# Altium project yard-ice.PrjPCB
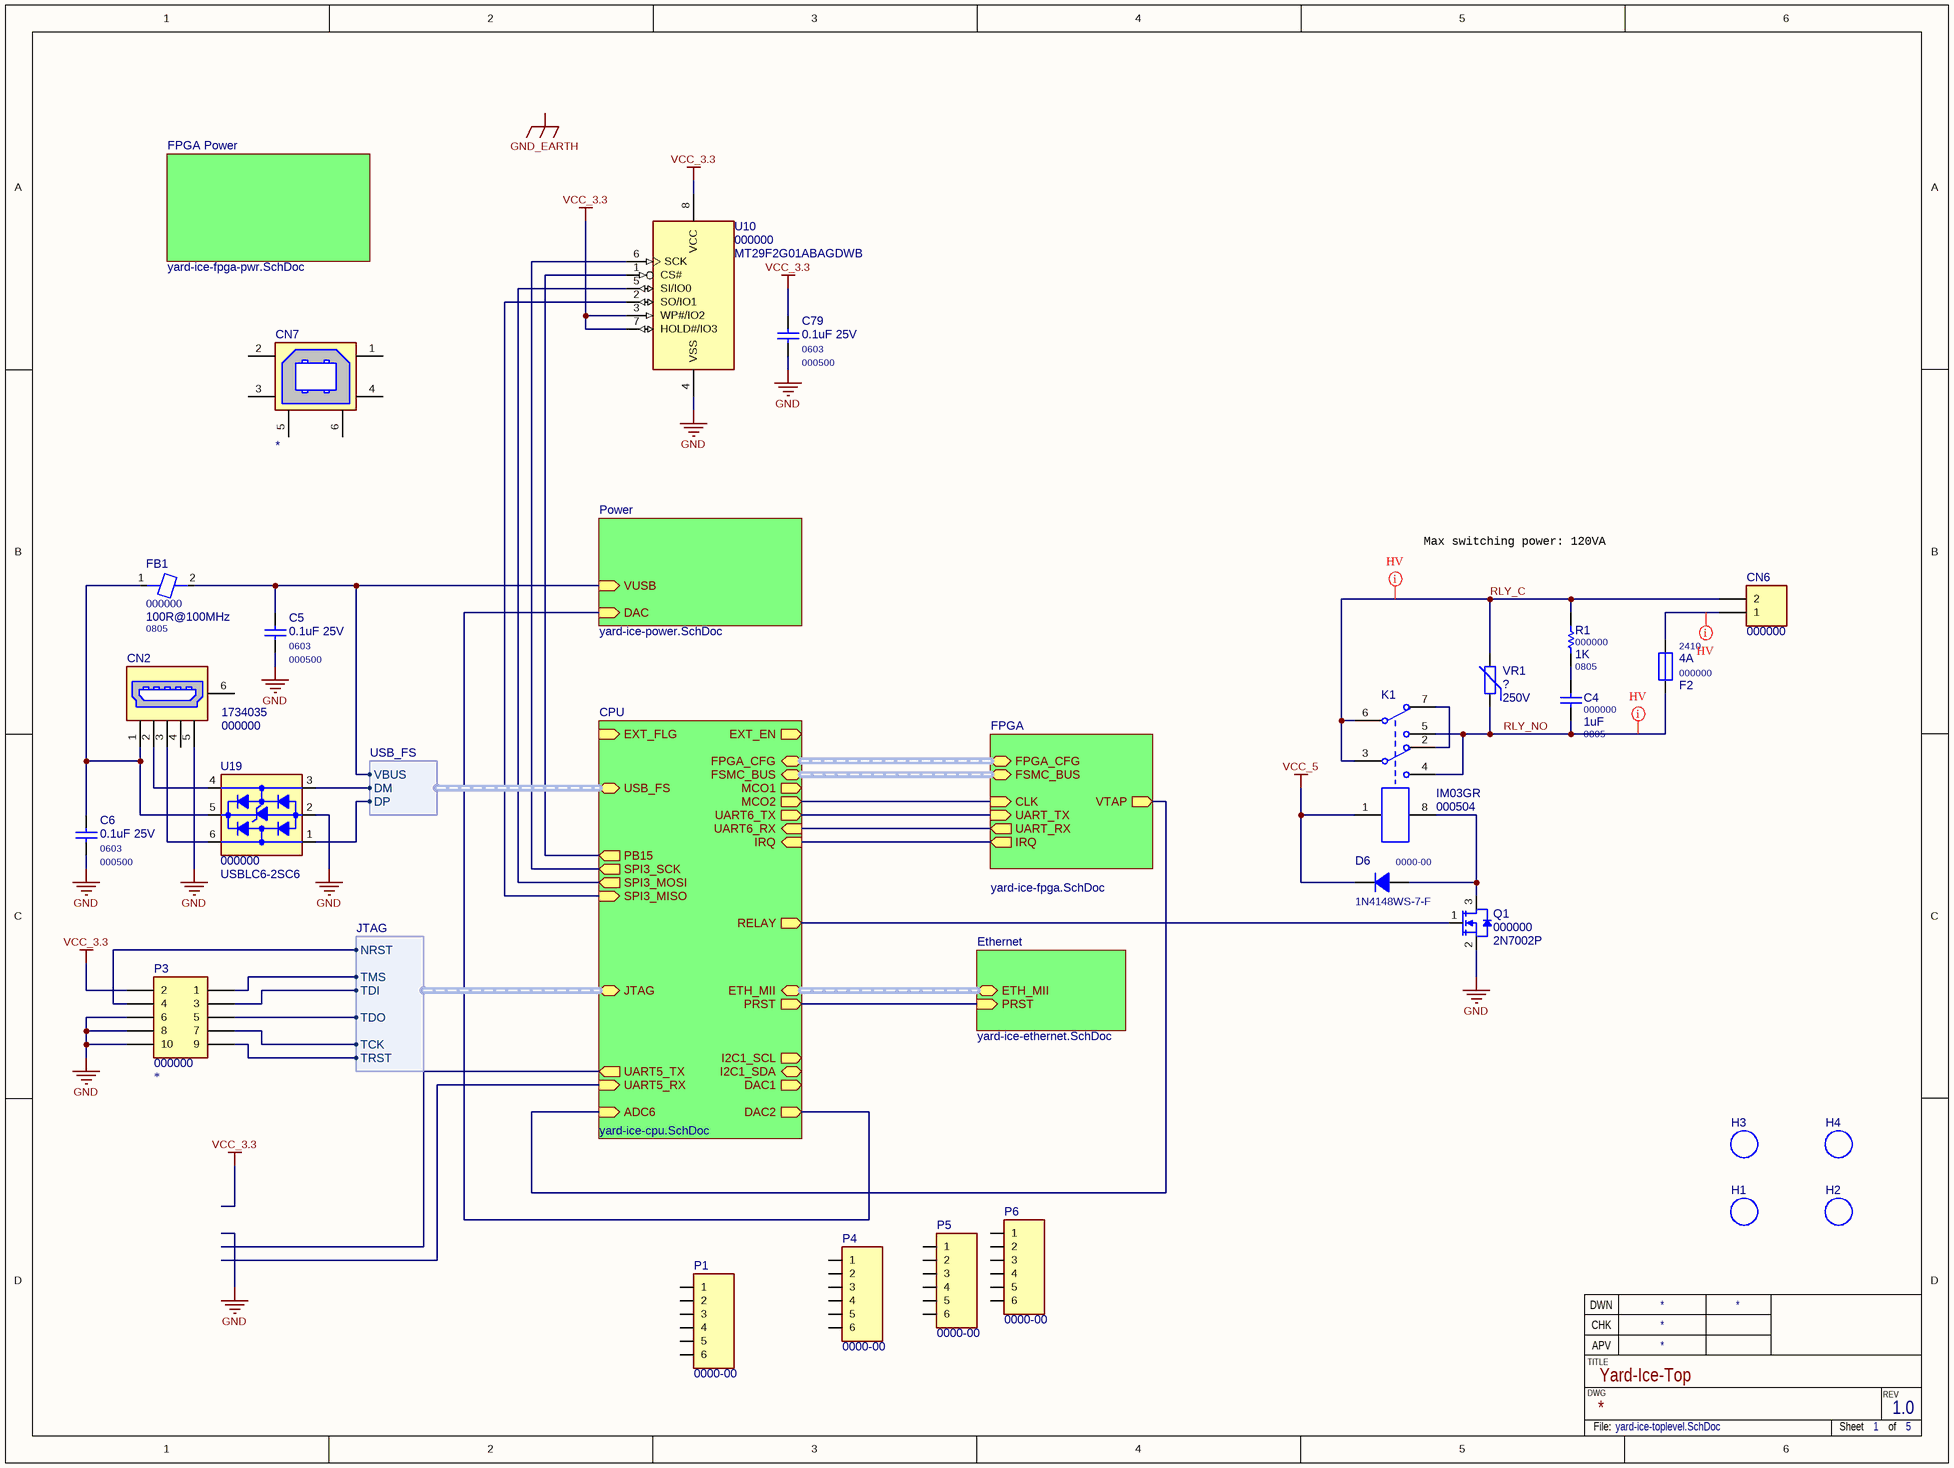
[diagram p0: yard-ice-toplevel.SchDoc]
6 sheets, 176 parts. Net scope: hierarchical (ports join the sheet entries above them; power ports are global).
Board file: yard-ice.PcbDoc
Sheets:
  yard-ice-toplevel.SchDoc
    Power = yard-ice-power.SchDoc
    CPU = yard-ice-cpu.SchDoc
    FPGA = yard-ice-fpga.SchDoc
    Ethernet = yard-ice-ethernet.SchDoc
    FPGA Power = yard-ice-fpga-pwr.SchDoc

## Sheet yard-ice-toplevel.SchDoc: Yard-Ice-Top
size 365 x 274 mm; Revision: 1.0; SheetNumber: 1; SheetTotal: 5

### Parts
C4  000000  value 1uF  Package: 0805  [C0805HV]
C5  000500  value 0.1uF 25V  Package: 0603  [C0603M]
C6  000500  value 0.1uF 25V  Package: 0603  [C0603M]
C79  000500  value 0.1uF 25V  Package: 0603  [C0603M]
CN2  value 1734035  [1734035]  (hidden comment: 000000)
CN6  000000  [691322110002]
CN7  *  [4-1734376]
D6  0000-00  MF PN: 1N4148WS-7-F  [SOD-323-M]
F2  000000  value 4A  Package: 2410  [F2410]
FB1  000000  value 100R@100MHz  Package: 0805  [L0805M]
H1  Hole Non Plated  [Hole NP 3.2x5.0x5.0]  (value not drawn)
H2  Hole Non Plated  [Hole NP 3.2x5.0x5.0]  (value not drawn)
H3  Hole Non Plated  [Hole NP 3.2x5.0x5.0]  (value not drawn)
H4  Hole Non Plated  [Hole NP 3.2x5.0x5.0]  (value not drawn)
K1  000504  value IM03GR  [Relay-10X6]
P1  0000-00  [SsW-106-01-G-S]
P3  000000  [TSW-105-07-G-D]
P4  0000-00  [SsW-106-01-G-S]
P5  0000-00  [SsW-106-01-G-S]
P6  0000-00  [SsW-106-01-G-S]
Q1  000000  value 2N7002P  [SOT-23-M]
R1  000000  value 1K  Package: 0805  [R0805HV]
U10  000000  value MT29F2G01ABAGDWB  [U-PDFN-8]
U19  000000  value USBLC6-2SC6  [SOT23-6L]
VR1  ?  value 250V  [MOV7x4.8-5.0]

### Sub-sheets
CPU = yard-ice-cpu.SchDoc: ETH_MII (harness ETH_MII), FSMC_BUS (harness FSMC_BUS), FPGA_CFG (harness FPGA_CFG), PRST (out), MCO2 (out), USB_FS (harness USB_FS), JTAG (harness JTAG), EXT_EN (out), EXT_FLG (in), ADC6 (in), DAC2 (out), I2C1_SDA (bidir), I2C1_SCL (out), UART6_TX (out), UART6_RX (in), UART5_TX (out), UART5_RX (in), RELAY (out), IRQ (in), DAC1 (out), SPI3_MISO (in), SPI3_MOSI (out), SPI3_SCK (out), PB15 (out), MCO1 (out)
Ethernet = yard-ice-ethernet.SchDoc: ETH_MII (harness ETH_MII), PRST (in)
FPGA = yard-ice-fpga.SchDoc: FSMC_BUS (harness FSMC_BUS), FPGA_CFG (harness FPGA_CFG), CLK (in), VTAP (out), UART_TX (in), UART_RX (out), IRQ (out)
FPGA Power = yard-ice-fpga-pwr.SchDoc: no entries
Power = yard-ice-power.SchDoc: VUSB (in), DAC (in)

### Harnesses
USB_FS: VBUS, DM, DP
JTAG: TDO, TDI, TCK, TMS, TRST, NRST

### Nets
GND: C5.2 C6.2 C79.2 CN2.5(SHIELD) P3.6 P3.8 P3.10 Q1.2(S) U10.4(VSS) U19.2(GND)
VCC_3.3: C79.1 P3.2 U10.3(WP#/IO2) U10.7(HOLD#/IO3) U10.8(VCC)
VCC_5: D6.2(K) K1.1
ADC12_IN6: sheet CPU/ADC6, sheet FPGA/VTAP
DAC2_OUT: sheet Power/DAC, sheet CPU/DAC2
JTCK: P3.7 ; sheet CPU/JTAG.TCK
JTDI: P3.3 ; sheet CPU/JTAG.TDI
JTDO: P3.5 ; sheet CPU/JTAG.TDO
JTMS: P3.1 ; sheet CPU/JTAG.TMS
JTRST: P3.9 ; sheet CPU/JTAG.TRST
MCO2: sheet CPU/MCO2, sheet FPGA/CLK
NRST: P3.4 ; sheet CPU/JTAG.NRST
OTG_FS_DM: U19.3(IO/2) ; sheet CPU/USB_FS.DM
OTG_FS_DP: U19.1(IO/1) ; sheet CPU/USB_FS.DP
OTG_FS_VBUS: C5.1 FB1.2 ; sheet Power/VUSB, sheet CPU/USB_FS.VBUS
PB15: U10.1(CS#) ; sheet CPU/PB15
PD6: sheet CPU/IRQ, sheet FPGA/IRQ
PE5: sheet CPU/PRST, sheet Ethernet/PRST
RLY_C: CN6.2 K1.3 K1.6 R1.2 VR1.2
RLY_NO: C4.2 F2.1 K1.4 K1.5 VR1.1
SPI2_NSS: Q1.1(G) ; sheet CPU/RELAY
SPI3_MISO: U10.2(SO/IO1) ; sheet CPU/SPI3_MISO
SPI3_MOSI: U10.5(SI/IO0) ; sheet CPU/SPI3_MOSI
SPI3_SCK: U10.6(SCK) ; sheet CPU/SPI3_SCK
USART6_RX: sheet CPU/UART6_RX, sheet FPGA/UART_RX
USART6_TX: sheet CPU/UART6_TX, sheet FPGA/UART_TX
NetC4_1: C4.1 R1.1
NetC6_1: C6.1 CN2.1 FB1.1 U19.5(VBUS)
NetCN2_2: CN2.2 U19.4(I/O2)
NetCN2_3: CN2.3 U19.6(I/O1)
NetCN6_1: CN6.1 F2.2
NetD6_1: D6.1(A) K1.8 Q1.3(D)
NetK1_2: K1.2 K1.7

Not connected (* = marked no-connect by the designer): CN2 4 6(SHIELD); CN7 1 2 3 4 5(SHIELD) 6(SHIELD); P1 1 2 3 4 5 6; P4 1 2 3 4 5 6; P5 1 2 3 4 5 6; P6 1 2 3 4 5 6

### Buses and harness runs
harness sheet CPU/ETH_MII = sheet Ethernet/ETH_MII
harness sheet CPU/FPGA_CFG = sheet FPGA/FPGA_CFG
harness sheet CPU/FSMC_BUS = sheet FPGA/FSMC_BUS

### Layout directives
net class HV: NetCN6_1, RLY_C, RLY_NO

### Notes on the sheet
- Max switching power: 120VA
- Labels drawn without touching a wire or pin: GND_EARTH
- TITLE
- CHK
- DWN
- APV
- DWG
- REV
- File:
- Sheet
- of

### Library data of the parts
C4 = C0805: SMD Ceramic Chip Capacitor - 0805; PN: 000000; ExtraInfo: *
C5 C6 C79 = C0603: SMD Ceramic Chip Capacitor - 0603 - X7R; MF PN: C1608X7R1E104K; MF: TDK; PN: 000500
CN2 = 1734035: USB Type B Mini - Right Angle - SMD; MF: Tyco; MF PN: 1734035-3; Package: SMT; PN: 000000; Digi-Key PN: A121553CT-ND; Price: 1.16131; Status: Stock
CN6 = Term Blk 2: Terminal Block, Header, 2-Pos; PN: 000000; Package: PTH; Value: *; ExtraInfo: *
CN7 = 4-1734376: USB Type B - Right Angle - Thru Hole; PN: *; Value: *; Package: *; ExtraInfo: *
D6 = 1N4148WS: Fast Switching Diode 100V 150mA; MF: Diodes Inc; PN: 0000-00; Package: SOD-323; ExtraInfo: *
F2 = F2410: PN: 000000; ExtraInfo: *; MF: *; MF PN: *
FB1 = FB0805: SMD Chip Ferrite Bead - 0805; PN: 000000; ExtraInfo: *; MF: *; MF PN: *
K1 = Relay-DPDT: Dual-Pole Dual-Throw Relay; MF: Tyco; PN: 000504; Package: SMT; MF PN: IM03GR
P1 P4-P6 = Header 6: Header, 6-Pin; MF: Samtec; Package: *; PN: 0000-00; ExtraInfo: *; Value: *
P3 = Header 5X2: Socket 5-Pin, Dual row; PN: 000000; Package: SMD; Value: *; ExtraInfo: *
Q1 = 2N7002P: N-Channel MOSFET 60V 360mA SOT-23; PN: 000000; Package: SOT-23; ExtraInfo: *
R1 = R0805: SMD Chip Resistor - 0805; PN: 000000; ExtraInfo: *
U10 = MT29F2G01ABAGDWB: 2Gb NANDl Flash Memory,  133MHz, SPI; MF: Micron; MF PN: MT29F2G01ABAGDWB-IT:G TR; PN: 000000; Package: 8VDFN; ExtraInfo: *; Digi-Key PN: 557-1664-1-ND; Price: 3.52500
U19 = USBLC6-2SC6: USB ESD Protection; PN: 0000-00; MF: STMicroelectronics; Package: ST23-6L; ExtraInfo: *; Digi-Key PN: 497-5235-1-ND; MF PN: USBLC6-2SC6; Price: 0.14025; Status: Stock
VR1 = Varistor: Varistor (Voltage-Sensitive Resistor); PN: ?; MF PN: *; Package: PTH; ExtraInfo: *; MF: *; Price: *; Digi-Key PN: *

## Sheet yard-ice-power.SchDoc: Yard-Ice-Power
size 365 x 274 mm; Revision: 1.0; SheetNumber: 2; SheetTotal: 5
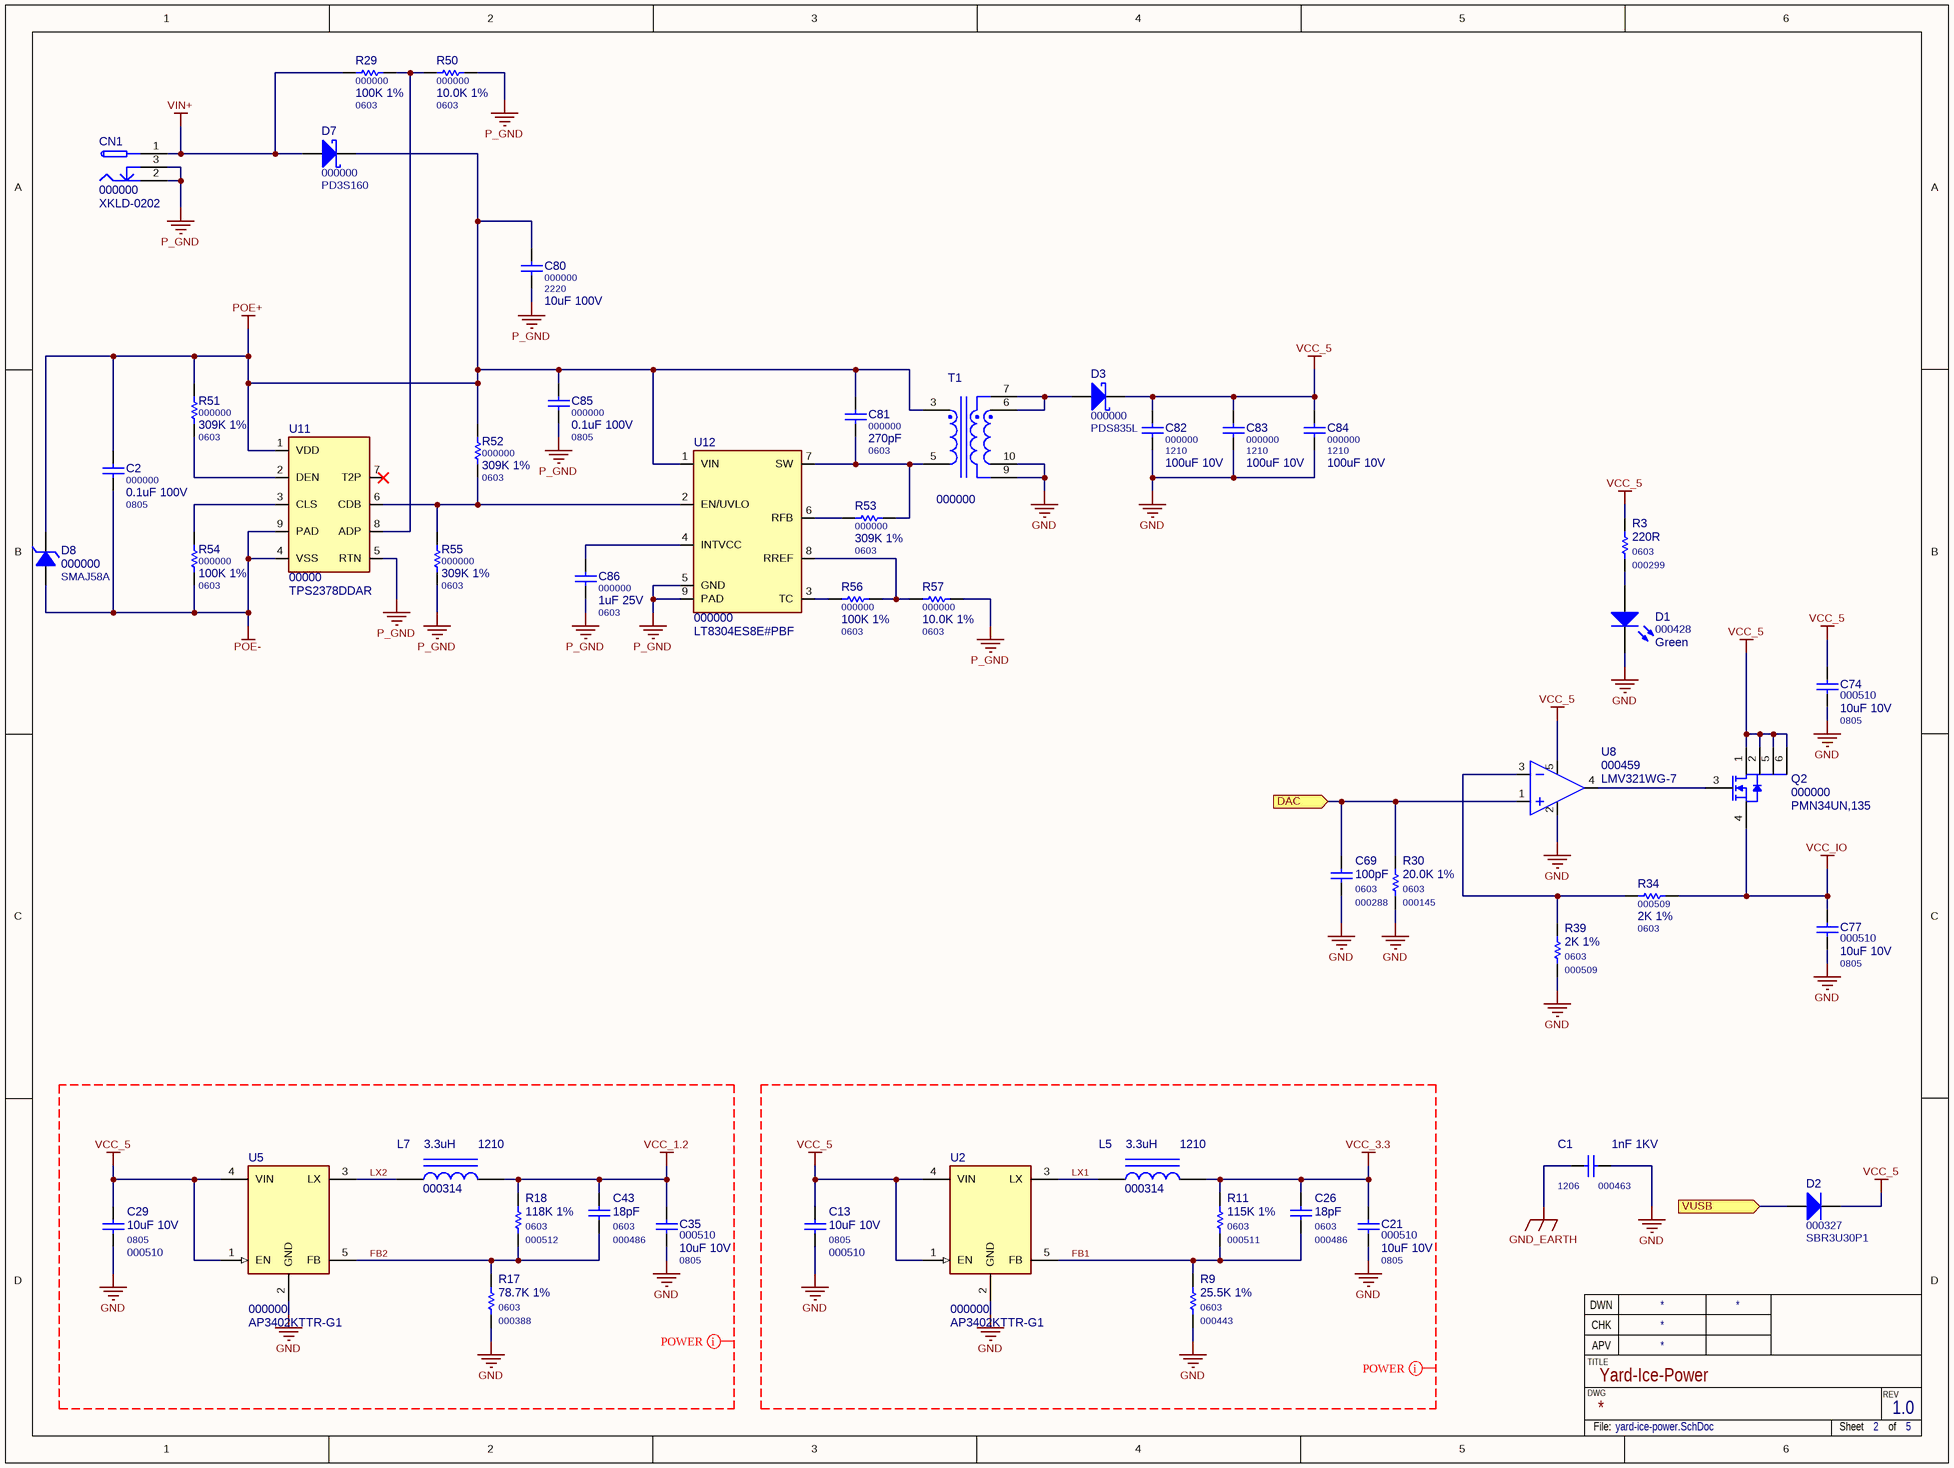
[diagram p1: yard-ice-power.SchDoc]

### Parts
C1  000463  value 1nF 1KV  Package: 1206  [C1206M]
C2  000000  value 0.1uF 100V  Package: 0805  [C0805HV]
C13  000510  value 10uF 10V  Package: 0805  [C0805M]
C21  000510  value 10uF 10V  Package: 0805  [C0805M]
C26  000486  value 18pF  Package: 0603  [C0603M]
C29  000510  value 10uF 10V  Package: 0805  [C0805M]
C35  000510  value 10uF 10V  Package: 0805  [C0805M]
C43  000486  value 18pF  Package: 0603  [C0603M]
C69  000288  value 100pF  Package: 0603  [C0603M]
C74  000510  value 10uF 10V  Package: 0805  [C0805M]
C77  000510  value 10uF 10V  Package: 0805  [C0805M]
C80  000000  value 10uF 100V  Package: 2220  [C2220M]
C81  000000  value 270pF  Package: 0603  [C0603HV]
C82  000000  value 100uF 10V  Package: 1210  [C1210M]
C83  000000  value 100uF 10V  Package: 1210  [C1210M]
C84  000000  value 100uF 10V  Package: 1210  [C1210M]
C85  000000  value 0.1uF 100V  Package: 0805  [C0805HV]
C86  000000  value 1uF 25V  Package: 0603  [C0603M]
CN1  000000  value XKLD-0202  [KLDX-0202]
D1  000428  value Green  [LED0805L LP]
D2  000327  value SBR3U30P1  [PowerDI 123]
D3  000000  value PDS835L  [PowerDI 5]
D7  000000  value PD3S160  [PowerDI 123]
D8  000000  value SMAJ58A  [DO-214AC]
L5  000314  value 3.3uH  Package: 1210  [L1210M]
L7  000314  value 3.3uH  Package: 1210  [L1210M]
Q2  000000  value PMN34UN,135  [SOT-26]
R3  000299  value 220R  Package: 0603  [R0603M]
R9  000443  value 25.5K 1%  Package: 0603  [R0603M]
R11  000511  value 115K 1%  Package: 0603  [R0603M]
R17  000388  value 78.7K 1%  Package: 0603  [R0603M]
R18  000512  value 118K 1%  Package: 0603  [R0603M]
R29  000000  value 100K 1%  Package: 0603  [R0603M]
R30  000145  value 20.0K 1%  Package: 0603  [R0603M]
R34  000509  value 2K 1%  Package: 0603  [R0603M]
R39  000509  value 2K 1%  Package: 0603  [R0603M]
R50  000000  value 10.0K 1%  Package: 0603  [R0603M]
R51  000000  value 309K 1%  Package: 0603  [R0603HV]
R52  000000  value 309K 1%  Package: 0603  [R0603HV]
R53  000000  value 309K 1%  Package: 0603  [R0603HV]
R54  000000  value 100K 1%  Package: 0603  [R0603M]
R55  000000  value 309K 1%  Package: 0603  [R0603HV]
R56  000000  value 100K 1%  Package: 0603  [R0603M]
R57  000000  value 10.0K 1%  Package: 0603  [R0603M]
T1  000000  [75031583X]
U2  000000  value AP3402KTTR-G1  [SOT23-5-M]
U5  000000  value AP3402KTTR-G1  [SOT23-5-M]
U8  000459  value LMV321WG-7  [SOT-25]
U11  00000  value TPS2378DDAR  [DDA (R-PDSO-G8)]
U12  000000  value LT8304ES8E#PBF  [S8E]

### Ports
DAC (in), VUSB (in)

### Nets
GND: C1.2 C13.2 C21.2 C29.2 C35.2 C69.2 C74.2 C77.2 C82.2 C83.2 C84.2 D1.2(K) R9.1 R17.1 R30.1 R39.1 T1.9 T1.10 U2.2(GND) U5.2(GND) U8.2(V-)
GND_EARTH: C1.1
P_GND: C80.2 C85.2 C86.2 CN1.2 CN1.3 R50.1 R55.2 R57.1 U11.5(RTN) U12.5(GND) U12.9(PAD)
POE+: C2.1 C80.1 C81.1 C85.1 D7.2(K) D8.2(K) R51.1 R52.1 T1.3 U11.1(VDD) U12.1(VIN)
POE-: C2.2 D8.1(A) R54.2 U11.4(VSS) U11.9(PAD)
VCC_1.2: C35.1 C43.1 L7.2 R18.2
VCC_3.3: C21.1 C26.1 L5.2 R11.2
VCC_5: C13.1 C29.1 C74.1 C82.1 C83.1 C84.1 D2.2(K) D3.2(K) Q2.1(D) Q2.2(D) Q2.5(D) Q2.6(D) R3.2 U2.1(EN) U2.4(VIN) U5.1(EN) U5.4(VIN) U8.5(V+)
VCC_IO: C77.1 Q2.4(S) R34.1
VIN+: CN1.1 D7.1(A) R29.2
DAC2_OUT: C69.1 R30.2 U8.1(IN+) ; port DAC
FB1: C26.2 R9.2 R11.1 U2.5(FB)
FB2: C43.2 R17.2 R18.1 U5.5(FB)
LX1: L5.1 U2.3(LX)
LX2: L7.1 U5.3(LX)
OTG_FS_VBUS: D2.1(A) ; port VUSB
NetC81_2: C81.2 R53.1 T1.5 U12.7(SW)
NetC86_1: C86.1 U12.4(INTVCC)
NetD1_1: D1.1(A) R3.1
NetD3_1: D3.1(A) T1.6 T1.7
NetQ2_3: Q2.3(G) U8.4(OUT)
NetR29_1: R29.1 R50.2 U11.8(ADP)
NetR34_2: R34.2 R39.2 U8.3(IN-)
NetR51_2: R51.2 U11.2(DEN)
NetR52_2: R52.2 R55.1 U11.6(CDB) U12.2(EN/UVLO)
NetR53_2: R53.2 U12.6(RFB)
NetR54_1: R54.1 U11.3(CLS)
NetR56_1: R56.1 R57.2 U12.8(RREF)
NetR56_2: R56.2 U12.3(TC)

Not connected (* = marked no-connect by the designer): U11 7(T2P)*

### Layout directives
net class POWER: FB1, FB2, GND, LX1, LX2, VCC_1.2, VCC_3.3, VCC_5

### Notes on the sheet
- TITLE
- CHK
- DWN
- APV
- DWG
- REV
- File:
- Sheet
- of

### Library data of the parts
C1 = C1206: SMD Ceramic Chip Capacitor - 1206; PN: 000463
C2 = C0805: SMD Ceramic Chip Capacitor - 0805; PN: 000000; ExtraInfo: *
C13 C21 C29 C35 = C0805: SMD Ceramic Chip Capacitor - 0805 - X7R; MF PN: C2012X7R1A106K; MF: TDK; PN: 000510
C26 C43 C69 C81 C86 = C0603: SMD Ceramic Chip Capacitor - 0603
  C26 C43: PN: 000486
  C69: PN: 000288
  C81 C86: PN: 000000; ExtraInfo: *
C74 C77 = C0805: SMD Ceramic Chip Capacitor - 0805 - X7R; MF PN: C2012X7R1A106K; PN: TDK; PN: 000510; MF: TDK
C80 = C2220: SMD Ceramic Chip Capacitor - 2220; MF: AVX; MF PN: 22201C106MAT2A; PN: 000000; ExtraInfo: *
C82-C84 = C1210: SMD Ceramic Chip Capacitor - 1210; ExtraInfo: 6XS; MF: Taiyo Yuden; MF PN: LMK325AC6107MM-P; PN: 000000; Price: 1.08452
C85 = C0805: SMD Ceramic Chip Capacitor - 0805; MF PN: GCM21BR72A104KA37K; PN: 000000; ExtraInfo: *
CN1 = XKLD-0202: Low Voltage Power Supply Connector; MF: KYCON; PN: 000000; ExtraInfo: *; Package: PTH; MF PN: XKLD-0202; Price: *; Digi-Key PN: *
D1 = LED0805LP: LED SMD 0805; Package: 0805; PN: 000428
D2 = SBR3U30P1: Super Barrier Rectifier; MF: Diodes Inc; PN: 000327; Package: PowerDI 123
D3 = PDS835L: Shottky Barrier Rectifier 25V 8A; MF PN: PDS835L-13; MF: Diodes Inc; PN: 000000; Package: PowerDI 5; ExtraInfo: *; Digi-Key PN: PDS835LDICT-ND; Price: 0.80369
D7 = PD3S160: Sshottky Barrier Rectifier 60V 1A; MF: Diodes Inc; PN: 000000; Package: PowerDI 123; ExtraInfo: *
D8 = SMAJXXA: Unidirectional Transiet Voltage Suppressor; MF: Bourns; PN: 000000; Package: SMA; ExtraInfo: *; MF PN: *
L5 L7 = L1210: SMD Wire Wound Inductor -  1210 (3225 metric); MF: Murata; MF PN: LQH32PN3R3NN0L; PN: 000314
Q2 = PMN34UN,135: N-Channel MOSFET 30V 4.9A 6TSOP; PN: 000000; Package: SOT23-6; ExtraInfo: *
R3 R9 R11 R17 R18 R29 R30 R34 R39 R50-R57 = R0603: SMD Chip Resistor - 0603
  R3: PN: 000299
  R9: PN: 000443
  R11: PN: 000511
  R17: PN: 000388
  R18: PN: 000512
  R29 R50-R57: PN: 000000; ExtraInfo: *
  R30: PN: 000145
  R34 R39: PN: 000509
T1 = 750315126: SMD Transformer; Value: 750315125; MF: Wurth; PN: 000000; ExtraInfo: *; Digi-Key PN: 1297-1195-1-ND; MF PN: 750315125; Price: 3.47870
U2 U5 = AP3429A: 2A Step-Down DC/DC Cnverter 1MHz Switching Frequency; MF: Diodes Inc; PN: 000000; Package: SOT-23-5; ExtraInfo: *; Digi-Key PN: AP3402KTTR-G1DICT-ND; MF PN: AP3402KTTR-G1; Price: 0.12375
U8 = LMV321WG-7: General Purpose, Low Voltage, Rail-to-Rail Output Operational Amplifier; MF: Diodes Inc; Package: SOT25; PN: 000459
U11 = TPS2378: PoE High-Power PD Interface; MF: Texas Instruments; PN: 00000; Package: 8-HSOP; ExtraInfo: *; MF PN: TPS2378DDAR
U12 = LT3804: 100V Isolated Flyback Converter; MF: Linear Technology; PN: 000000; Package: 8-SOIC-EP; ExtraInfo: *; MF PN: LT8304ES8E#PBF; Digi-Key PN: LT8304ES8E#PBF-ND; Price: 6.42920

## Sheet yard-ice-cpu.SchDoc: Yard-Ice-CPU
size 365 x 274 mm; Revision: 1.0; SheetNumber: 3; SheetTotal: 5
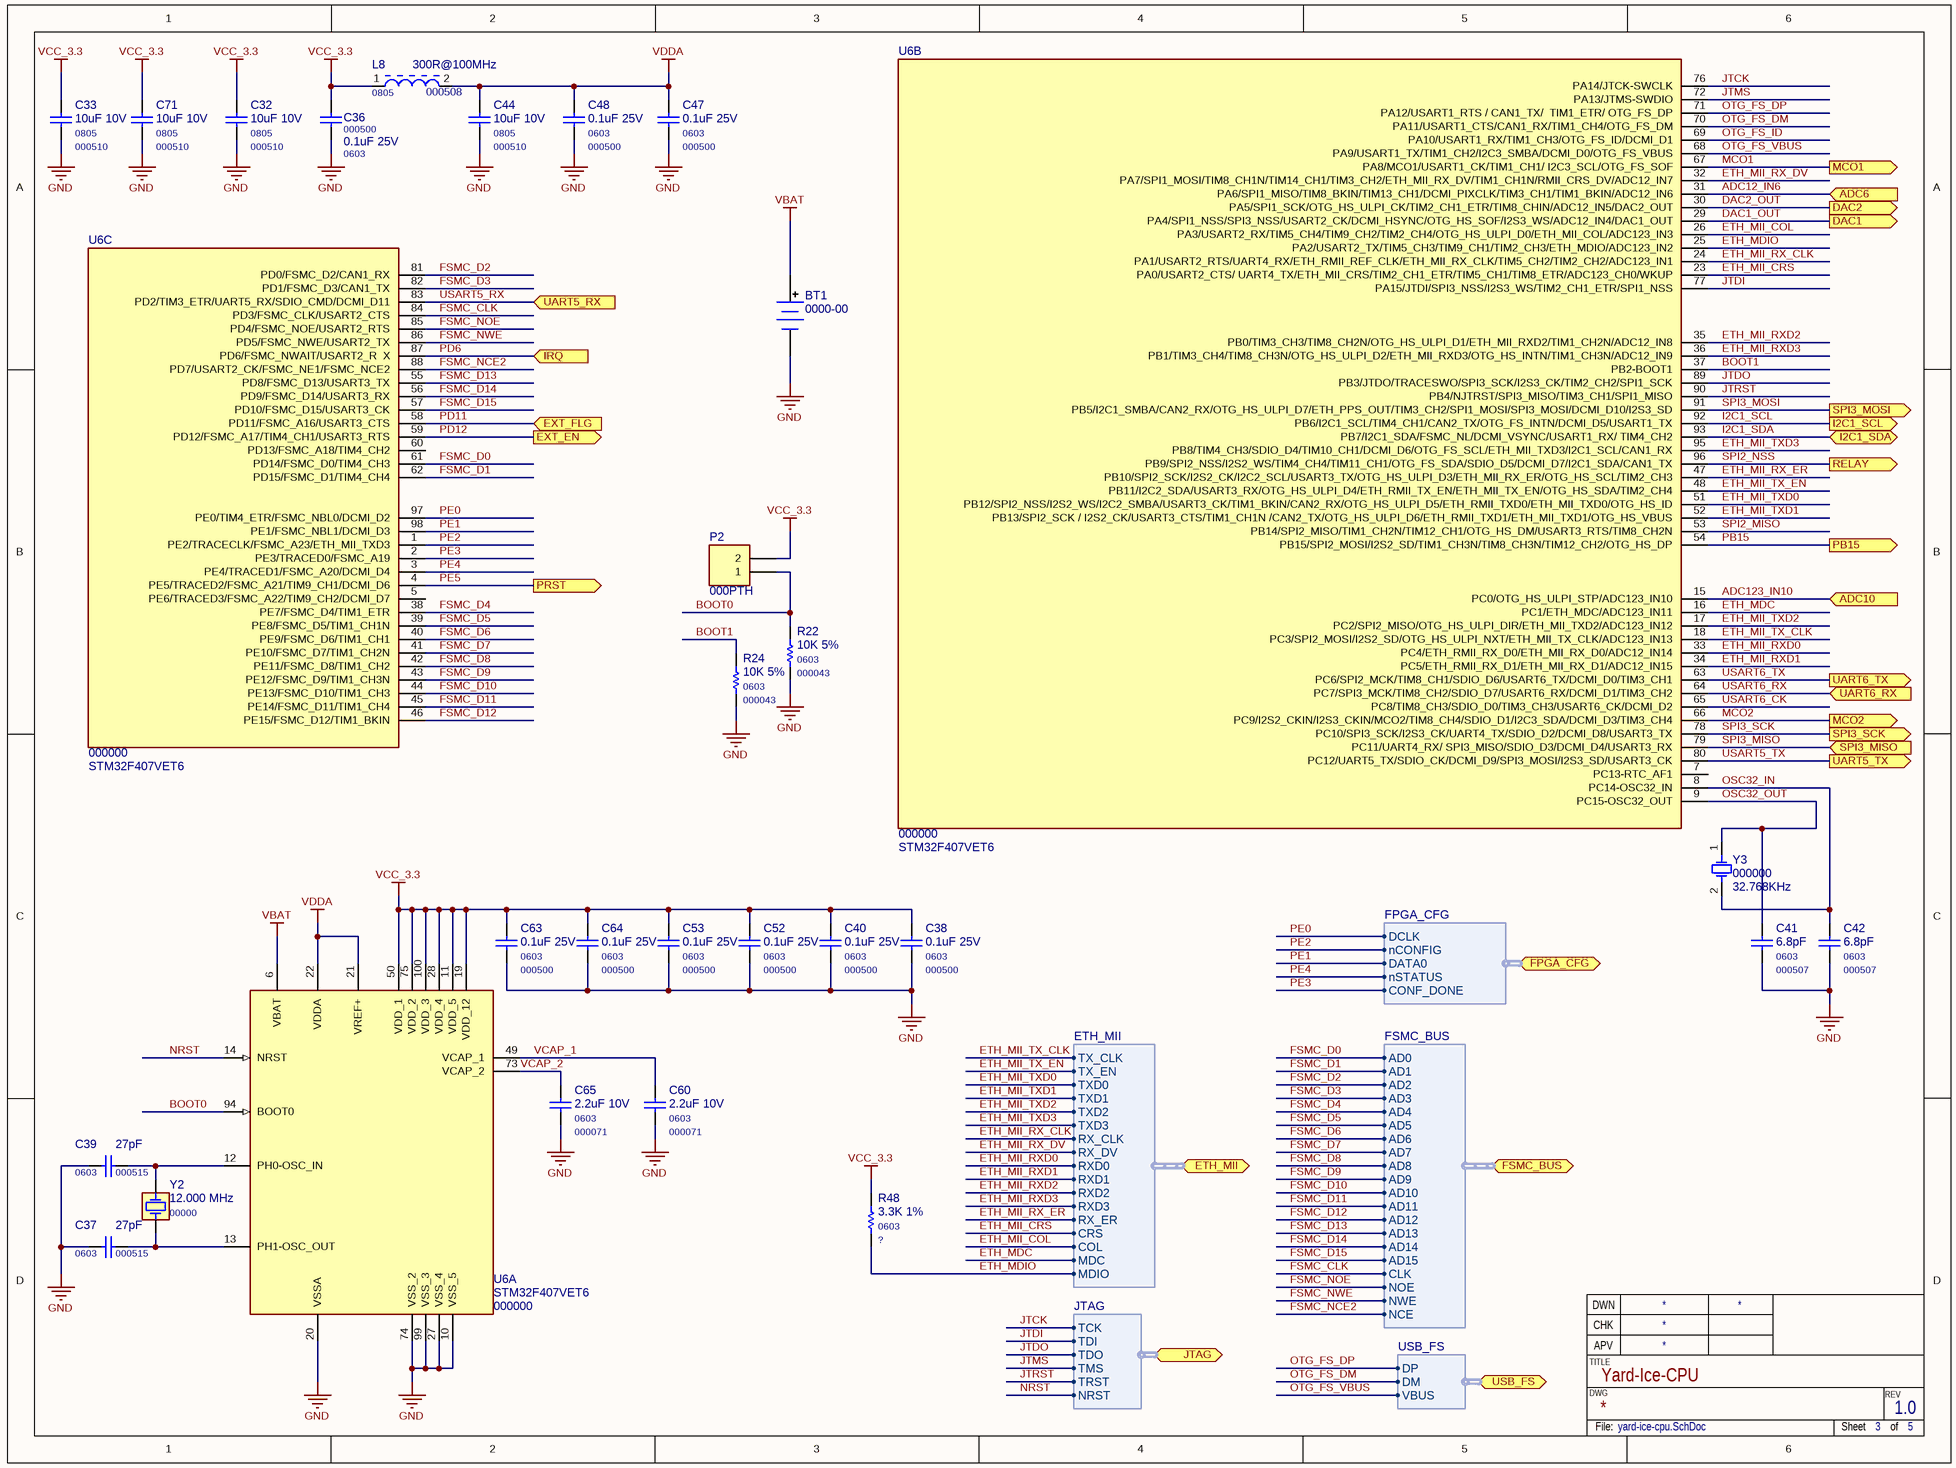
[diagram p2: yard-ice-cpu.SchDoc]

### Parts
BT1  0000-00  [CR-1632/VCN]
C32  000510  value 10uF 10V  Package: 0805  [C0805M]
C33  000510  value 10uF 10V  Package: 0805  [C0805M]
C36  000500  value 0.1uF 25V  Package: 0603  [C0603M]
C37  000515  value 27pF  Package: 0603  [C0603M]
C38  000500  value 0.1uF 25V  Package: 0603  [C0603M]
C39  000515  value 27pF  Package: 0603  [C0603M]
C40  000500  value 0.1uF 25V  Package: 0603  [C0603M]
C41  000507  value 6.8pF  Package: 0603  [C0603M]
C42  000507  value 6.8pF  Package: 0603  [C0603M]
C44  000510  value 10uF 10V  Package: 0805  [C0805M]
C47  000500  value 0.1uF 25V  Package: 0603  [C0603M]
C48  000500  value 0.1uF 25V  Package: 0603  [C0603M]
C52  000500  value 0.1uF 25V  Package: 0603  [C0603M]
C53  000500  value 0.1uF 25V  Package: 0603  [C0603M]
C60  000071  value 2.2uF 10V  Package: 0603  [C0603M]
C63  000500  value 0.1uF 25V  Package: 0603  [C0603M]
C64  000500  value 0.1uF 25V  Package: 0603  [C0603M]
C65  000071  value 2.2uF 10V  Package: 0603  [C0603M]
C71  000510  value 10uF 10V  Package: 0805  [C0805M]
L8  000508  value 300R@100MHz  Package: 0805  [L0805M]
P2  000PTH  [TSW-102-07-G-S]
R22  000043  value 10K 5%  Package: 0603  [R0603M]
R24  000043  value 10K 5%  Package: 0603  [R0603M]
R48  ?  value 3.3K 1%  Package: 0603  [R0603M]
U6  000000  value STM32F407VET6  [LQFP100]  (parts A,B,C of 3)
Y2  00000  value 12.000 MHz  [ABM3-H]
Y3  000000  value 32.768KHz  [CA-301-V]

### Ports
ADC6 (in), ADC10 (in), DAC1 (out), DAC2 (out), ETH_MII (harness ETH_MII), EXT_EN (out), EXT_FLG (in), FPGA_CFG (harness FPGA_CFG), FSMC_BUS (harness FSMC_BUS), I2C1_SCL (out), I2C1_SDA (bidir), IRQ (in), JTAG (harness JTAG), MCO1 (out), MCO2 (out), PB15 (out), PRST (out), RELAY (out), SPI3_MISO (in), SPI3_MOSI (out), SPI3_SCK (out), UART5_RX (in), UART5_TX (out), UART6_RX (in), UART6_TX (out), USB_FS (harness USB_FS)

### Harnesses
ETH_MII: TX_CLK, TX_EN, TXD0, TXD1, TXD2, TXD3, RX_CLK, RX_DV, RXD0, RXD1, RXD2, RXD3, RX_ER, CRS, COL, MDC, MDIO
FSMC_BUS: AD0, AD1, AD2, AD3, AD4, AD5, AD6, AD7, AD8, AD9, AD10, AD11, AD12, AD13, AD14, AD15, CLK, NOE, NWE, NCE
FPGA_CFG: CONF_DONE, nSTATUS, DATA0, nCONFIG, DCLK
USB_FS: VBUS, DM, DP
JTAG: TDO, TDI, TCK, TMS, TRST, NRST

### Nets
GND: BT1.2(-) C32.2 C33.2 C36.2 C37.1 C38.2 C39.1 C40.2 C41.1 C42.1 C44.2 C47.2 C48.2 C52.2 C53.2 C60.2 C63.2 C64.2 C65.2 C71.2 R22.1 R24.1 U6.10(VSS_5) U6.20(VSSA) U6.27(VSS_4) U6.74(VSS_2) U6.99(VSS_3)
VBAT: BT1.1(+) U6.6(VBAT)
VCC_3.3: C32.1 C33.1 C36.1 C38.1 C40.1 C52.1 C53.1 C63.1 C64.1 C71.1 L8.1 P2.2 R48.2 U6.11(VDD_5) U6.19(VDD_12) U6.28(VDD_4) U6.50(VDD_1) U6.75(VDD_2) U6.100(VDD_3)
VDDA: C44.1 C47.1 C48.1 L8.2 U6.21(VREF+) U6.22(VDDA)
ADC12_IN6: U6.31(PA6/SPI1_MISO/TIM8_BKIN/TIM13_CH1/DCMI_PIXCLK/TIM3_CH1/TIM1_BKIN/ADC12_IN6) ; port ADC6
ADC123_IN10: U6.15(PC0/OTG_HS_ULPI_STP/ADC123_IN10) ; port ADC10
BOOT0: P2.1 R22.2 U6.94(BOOT0)
BOOT1: R24.2 U6.37(PB2-BOOT1)
DAC1_OUT: U6.29(PA4/SPI1_NSS/SPI3_NSS/USART2_CK/DCMI_HSYNC/OTG_HS_SOF/I2S3_WS/ADC12_IN4/DAC1_OUT) ; port DAC1
DAC2_OUT: U6.30(PA5/SPI1_SCK/OTG_HS_ULPI_CK/TIM2_CH1_ETR/TIM8_CHIN/ADC12_IN5/DAC2_OUT) ; port DAC2
ETH_MDC: U6.16(PC1/ETH_MDC/ADC123_IN11) ; port ETH_MII.MDC
ETH_MDIO: R48.1 U6.25(PA2/USART2_TX/TIM5_CH3/TIM9_CH1/TIM2_CH3/ETH_MDIO/ADC123_IN2) ; port ETH_MII.MDIO
ETH_MII_COL: U6.26(PA3/USART2_RX/TIM5_CH4/TIM9_CH2/TIM2_CH4/OTG_HS_ULPI_D0/ETH_MII_COL/ADC123_IN3) ; port ETH_MII.COL
ETH_MII_CRS: U6.23(PA0/USART2_CTS/_UART4_TX/ETH_MII_CRS/TIM2_CH1_ETR/TIM5_CH1/TIM8_ETR/ADC123_CH0/WKUP) ; port ETH_MII.CRS
ETH_MII_RX_CLK: U6.24(PA1/USART2_RTS/UART4_RX/ETH_RMII_REF_CLK/ETH_MII_RX_CLK/TIM5_CH2/TIM2_CH2/ADC123_IN1) ; port ETH_MII.RX_CLK
ETH_MII_RX_DV: U6.32(PA7/SPI1_MOSI/TIM8_CH1N/TIM14_CH1/TIM3_CH2/ETH_MII_RX_DV/TIM1_CH1N/RMII_CRS_DV/ADC12_IN7) ; port ETH_MII.RX_DV
ETH_MII_RX_ER: U6.47(PB10/SPI2_SCK/I2S2_CK/I2C2_SCL/USART3_TX/OTG_HS_ULPI_D3/ETH_MII_RX_ER/OTG_HS_SCL/TIM2_CH3) ; port ETH_MII.RX_ER
ETH_MII_RXD0: U6.33(PC4/ETH_RMII_RX_D0/ETH_MII_RX_D0/ADC12_IN14) ; port ETH_MII.RXD0
ETH_MII_RXD1: U6.34(PC5/ETH_RMII_RX_D1/ETH_MII_RX_D1/ADC12_IN15) ; port ETH_MII.RXD1
ETH_MII_RXD2: U6.35(PB0/TIM3_CH3/TIM8_CH2N/OTG_HS_ULPI_D1/ETH_MII_RXD2/TIM1_CH2N/ADC12_IN8) ; port ETH_MII.RXD2
ETH_MII_RXD3: U6.36(PB1/TIM3_CH4/TIM8_CH3N/OTG_HS_ULPI_D2/ETH_MII_RXD3/OTG_HS_INTN/TIM1_CH3N/ADC12_IN9) ; port ETH_MII.RXD3
ETH_MII_TX_CLK: U6.18(PC3/SPI2_MOSI/I2S2_SD/OTG_HS_ULPI_NXT/ETH_MII_TX_CLK/ADC123_IN13) ; port ETH_MII.TX_CLK
ETH_MII_TX_EN: U6.48(PB11/I2C2_SDA/USART3_RX/OTG_HS_ULPI_D4/ETH_RMII_TX_EN/ETH_MII_TX_EN/OTG_HS_SDA/TIM2_CH4) ; port ETH_MII.TX_EN
ETH_MII_TXD0: U6.51(PB12/SPI2_NSS/I2S2_WS/I2C2_SMBA/USART3_CK/TIM1_BKIN/CAN2_RX/OTG_HS_ULPI_D5/ETH_RMII_TXD0/ETH_MII_TXD0/OTG_HS_ID) ; port ETH_MII.TXD0
ETH_MII_TXD1: U6.52(PB13/SPI2_SCK_/_I2S2_CK/USART3_CTS/TIM1_CH1N_/CAN2_TX/OTG_HS_ULPI_D6/ETH_RMII_TXD1/ETH_MII_TXD1/OTG_HS_VBUS) ; port ETH_MII.TXD1
ETH_MII_TXD2: U6.17(PC2/SPI2_MISO/OTG_HS_ULPI_DIR/ETH_MII_TXD2/ADC123_IN12) ; port ETH_MII.TXD2
ETH_MII_TXD3: U6.95(PB8/TIM4_CH3/SDIO_D4/TIM10_CH1/DCMI_D6/OTG_FS_SCL/ETH_MII_TXD3/I2C1_SCL/CAN1_RX) ; port ETH_MII.TXD3
FSMC_CLK: U6.84(PD3/FSMC_CLK/USART2_CTS) ; port FSMC_BUS.CLK
FSMC_D0: U6.61(PD14/FSMC_D0/TIM4_CH3) ; port FSMC_BUS.AD0
FSMC_D1: U6.62(PD15/FSMC_D1/TIM4_CH4) ; port FSMC_BUS.AD1
FSMC_D2: U6.81(PD0/FSMC_D2/CAN1_RX) ; port FSMC_BUS.AD2
FSMC_D3: U6.82(PD1/FSMC_D3/CAN1_TX) ; port FSMC_BUS.AD3
FSMC_D4: U6.38(PE7/FSMC_D4/TIM1_ETR) ; port FSMC_BUS.AD4
FSMC_D5: U6.39(PE8/FSMC_D5/TIM1_CH1N) ; port FSMC_BUS.AD5
FSMC_D6: U6.40(PE9/FSMC_D6/TIM1_CH1) ; port FSMC_BUS.AD6
FSMC_D7: U6.41(PE10/FSMC_D7/TIM1_CH2N) ; port FSMC_BUS.AD7
FSMC_D8: U6.42(PE11/FSMC_D8/TIM1_CH2) ; port FSMC_BUS.AD8
FSMC_D9: U6.43(PE12/FSMC_D9/TIM1_CH3N) ; port FSMC_BUS.AD9
FSMC_D10: U6.44(PE13/FSMC_D10/TIM1_CH3) ; port FSMC_BUS.AD10
FSMC_D11: U6.45(PE14/FSMC_D11/TIM1_CH4) ; port FSMC_BUS.AD11
FSMC_D12: U6.46(PE15/FSMC_D12/TIM1_BKIN) ; port FSMC_BUS.AD12
FSMC_D13: U6.55(PD8/FSMC_D13/USART3_TX) ; port FSMC_BUS.AD13
FSMC_D14: U6.56(PD9/FSMC_D14/USART3_RX) ; port FSMC_BUS.AD14
FSMC_D15: U6.57(PD10/FSMC_D15/USART3_CK) ; port FSMC_BUS.AD15
FSMC_NCE2: U6.88(PD7/USART2_CK/FSMC_NE1/FSMC_NCE2) ; port FSMC_BUS.NCE  [project net FSMC_NCE]
FSMC_NOE: U6.85(PD4/FSMC_NOE/USART2_RTS) ; port FSMC_BUS.NOE
FSMC_NWE: U6.86(PD5/FSMC_NWE/USART2_TX) ; port FSMC_BUS.NWE
I2C1_SCL: U6.92(PB6/I2C1_SCL/TIM4_CH1/CAN2_TX/OTG_FS_INTN/DCMI_D5/USART1_TX) ; port I2C1_SCL
I2C1_SDA: U6.93(PB7/I2C1_SDA/FSMC_NL/DCMI_VSYNC/USART1_RX/_TIM4_CH2) ; port I2C1_SDA
JTCK: U6.76(PA14/JTCK-SWCLK) ; port JTAG.TCK
JTDI: U6.77(PA15/JTDI/SPI3_NSS/I2S3_WS/TIM2_CH1_ETR/SPI1_NSS) ; port JTAG.TDI
JTDO: U6.89(PB3/JTDO/TRACESWO/SPI3_SCK/I2S3_CK/TIM2_CH2/SPI1_SCK) ; port JTAG.TDO
JTMS: U6.72(PA13/JTMS-SWDIO) ; port JTAG.TMS
JTRST: U6.90(PB4/NJTRST/SPI3_MISO/TIM3_CH1/SPI1_MISO) ; port JTAG.TRST
MCO1: U6.67(PA8/MCO1/USART1_CK/TIM1_CH1/_I2C3_SCL/OTG_FS_SOF) ; port MCO1
MCO2: U6.66(PC9/I2S2_CKIN/I2S3_CKIN/MCO2/TIM8_CH4/SDIO_D1/I2C3_SDA/DCMI_D3/TIM3_CH4) ; port MCO2
NRST: U6.14(NRST) ; port JTAG.NRST
OSC32_IN: C42.2 U6.8(PC14-OSC32_IN) Y3.2
OSC32_OUT: C41.2 U6.9(PC15-OSC32_OUT) Y3.1
OTG_FS_DM: U6.70(PA11/USART1_CTS/CAN1_RX/TIM1_CH4/OTG_FS_DM) ; port USB_FS.DM
OTG_FS_DP: U6.71(PA12/USART1_RTS_/_CAN1_TX/__TIM1_ETR/_OTG_FS_DP) ; port USB_FS.DP
OTG_FS_ID: U6.69(PA10/USART1_RX/TIM1_CH3/OTG_FS_ID/DCMI_D1)
OTG_FS_VBUS: U6.68(PA9/USART1_TX/TIM1_CH2/I2C3_SMBA/DCMI_D0/OTG_FS_VBUS) ; port USB_FS.VBUS
PB15: U6.54(PB15/SPI2_MOSI/I2S2_SD/TIM1_CH3N/TIM8_CH3N/TIM12_CH2/OTG_HS_DP) ; port PB15
PD6: U6.87(PD6/FSMC_NWAIT/USART2_R__X) ; port IRQ
PD11: U6.58(PD11/FSMC_A16/USART3_CTS) ; port EXT_FLG
PD12: U6.59(PD12/FSMC_A17/TIM4_CH1/USART3_RTS) ; port EXT_EN
PE0: U6.97(PE0/TIM4_ETR/FSMC_NBL0/DCMI_D2) ; port FPGA_CFG.DCLK
PE1: U6.98(PE1/FSMC_NBL1/DCMI_D3) ; port FPGA_CFG.DATA0
PE2: U6.1(PE2/TRACECLK/FSMC_A23/ETH_MII_TXD3) ; port FPGA_CFG.nCONFIG
PE3: U6.2(PE3/TRACED0/FSMC_A19) ; port FPGA_CFG.CONF_DONE
PE4: U6.3(PE4/TRACED1/FSMC_A20/DCMI_D4) ; port FPGA_CFG.nSTATUS
PE5: U6.4(PE5/TRACED2/FSMC_A21/TIM9_CH1/DCMI_D6) ; port PRST
SPI2_MISO: U6.53(PB14/SPI2_MISO/TIM1_CH2N/TIM12_CH1/OTG_HS_DM/USART3_RTS/TIM8_CH2N)
SPI2_NSS: U6.96(PB9/SPI2_NSS/I2S2_WS/TIM4_CH4/TIM11_CH1/OTG_FS_SDA/SDIO_D5/DCMI_D7/I2C1_SDA/CAN1_TX) ; port RELAY
SPI3_MISO: U6.79(PC11/UART4_RX/_SPI3_MISO/SDIO_D3/DCMI_D4/USART3_RX) ; port SPI3_MISO
SPI3_MOSI: U6.91(PB5/I2C1_SMBA/CAN2_RX/OTG_HS_ULPI_D7/ETH_PPS_OUT/TIM3_CH2/SPI1_MOSI/SPI3_MOSI/DCMI_D10/I2S3_SD) ; port SPI3_MOSI
SPI3_SCK: U6.78(PC10/SPI3_SCK/I2S3_CK/UART4_TX/SDIO_D2/DCMI_D8/USART3_TX) ; port SPI3_SCK
USART5_RX: U6.83(PD2/TIM3_ETR/UART5_RX/SDIO_CMD/DCMI_D11) ; port UART5_RX
USART5_TX: U6.80(PC12/UART5_TX/SDIO_CK/DCMI_D9/SPI3_MOSI/I2S3_SD/USART3_CK) ; port UART5_TX
USART6_CK: U6.65(PC8/TIM8_CH3/SDIO_D0/TIM3_CH3/USART6_CK/DCMI_D2)
USART6_RX: U6.64(PC7/SPI3_MCK/TIM8_CH2/SDIO_D7/USART6_RX/DCMI_D1/TIM3_CH2) ; port UART6_RX
USART6_TX: U6.63(PC6/SPI2_MCK/TIM8_CH1/SDIO_D6/USART6_TX/DCMI_D0/TIM3_CH1) ; port UART6_TX
VCAP_1: C60.1 U6.49(VCAP_1)
VCAP_2: C65.1 U6.73(VCAP_2)
NetC37_2: C37.2 U6.13(PH1-OSC_OUT) Y2.2
NetC39_2: C39.2 U6.12(PH0-OSC_IN) Y2.1

Not connected (* = marked no-connect by the designer): U6 5(PE6/TRACED3/FSMC_A22/TIM9_CH2/DCMI_D7) 7(PC13-RTC_AF1) 60(PD13/FSMC_A18/TIM4_CH2)

### Notes on the sheet
- TITLE
- CHK
- DWN
- APV
- DWG
- REV
- File:
- Sheet
- of

### Library data of the parts
BT1 = CR-1632/VCN: PTH 16mm SMD Battery Vertical; MF: Panasonic; PN: 0000-00; ExtraInfo: *; Value: CR-1632/VCN; Package: *; Class: Battery; MF PN: CR-1632/VCN
C32 C33 C71 = C0805: as C74 on sheet yard-ice-power; PN: 000510; MF: TDK
C36 C38 C40 C47 C48 C52 C53 C63 C64 = C0603: as C5 on sheet yard-ice-toplevel; PN: 000500
C37 C39 C41 C42 = C0603: SMD Ceramic Chip Capacitor - 0603
  C37 C39: PN: 000515
  C41 C42: PN: 000507
C44 = C0805: as C13 on sheet yard-ice-power; PN: 000510
C60 C65 = C0603: SMD Ceramic Chip Capacitor - 0603 - X7R; MF: Taiyo Yuden; MF PN: LMK107B7225KA-T; PN: 000071
L8 = L0805: SMD Ferrite Bead 0805; MF PN: MMZ2012Y301B; MF: TDK; PN: 000508
P2 = Header 2: Header, 2-Pin; Value: 2x1; PN: 000PTH; Package: PTH
R22 R24 R48 = R0603: SMD Chip Resistor - 0603
  R22 R24: PN: 000043
  R48: PN: ?
U6 = STM32F407VET6: Package: LQFP100; PN: 000000; ExtraInfo: *
Y2 = ABM3: Miniature Ceramic SMD Crystal; MF: Abracon; MF PN: ABM3-12.000MHZ-B2-T; Package: ABM3; PN: 00000
Y3 = CA-301: Cylinder Crystal Unit; MF: Epson; PN: 000000; ExtraInfo: *

## Sheet yard-ice-fpga.SchDoc: Yard-Ice-FPGA
size 365 x 274 mm; Revision: 1.0; SheetNumber: 4; SheetTotal: 5
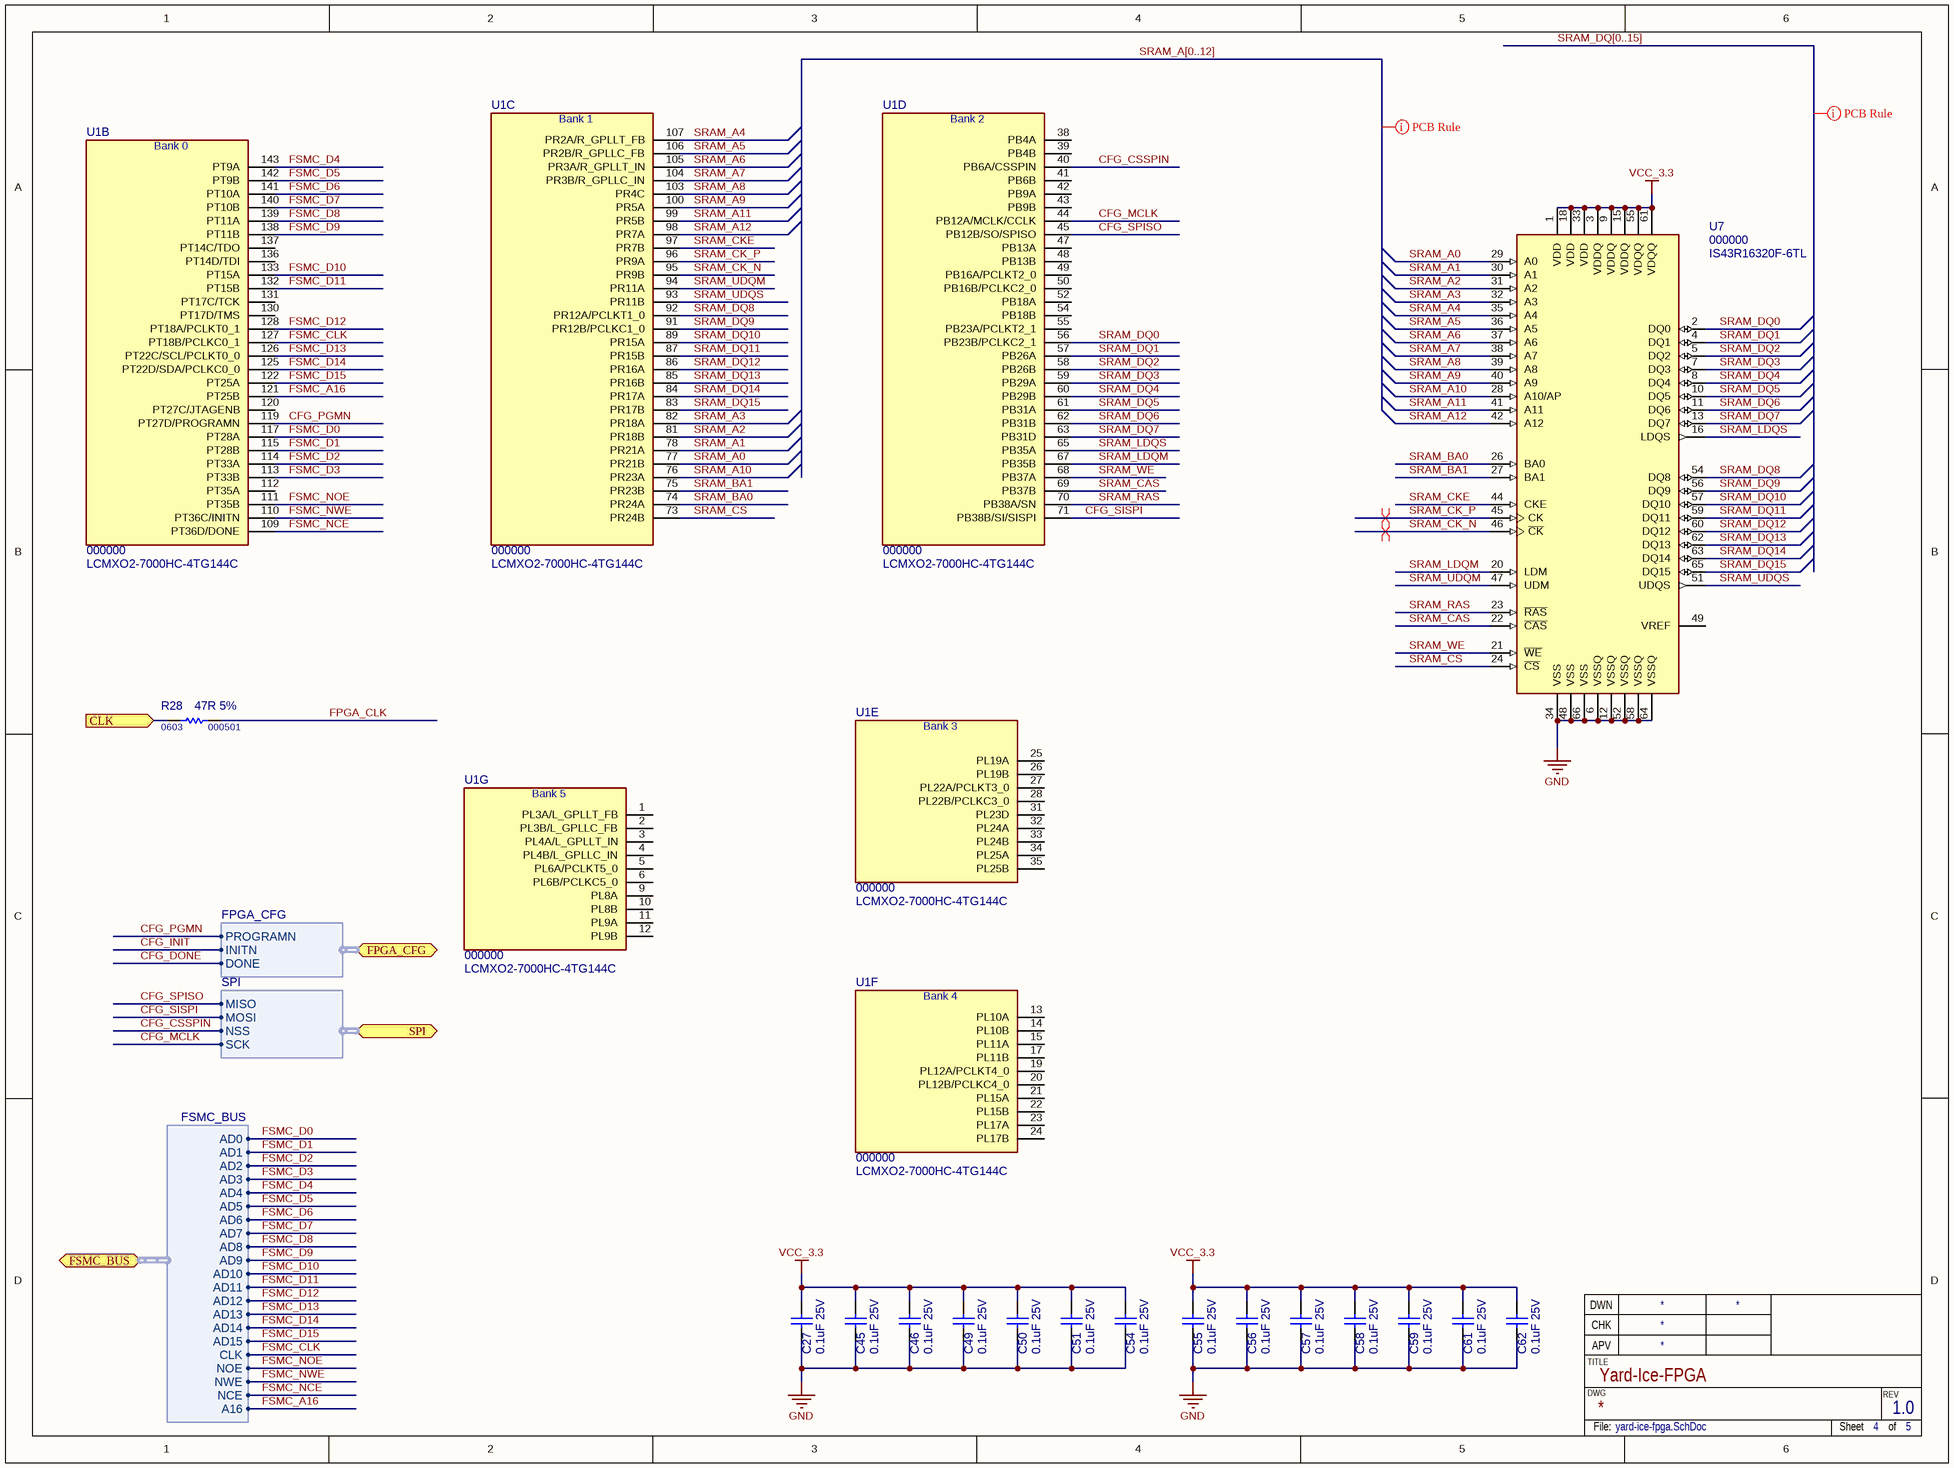
[diagram p3: yard-ice-fpga.SchDoc]

### Parts
(Parts that share a designator on the sheet are numbered #1, #2 ... from top to bottom, then left to right.)
C27#1  value 0.1uF 25V  [C0603M]  (hidden comment: 000500)
C45#1  value 0.1uF 25V  [C0603M]  (hidden comment: 000500)
C46#1  value 0.1uF 25V  [C0603M]  (hidden comment: 000500)
C49  value 0.1uF 25V  [C0603M]  (hidden comment: 000500)
C50  value 0.1uF 25V  [C0603M]  (hidden comment: 000500)
C51  value 0.1uF 25V  [C0603M]  (hidden comment: 000500)
C54  value 0.1uF 25V  [C0603M]  (hidden comment: 000500)
C55  value 0.1uF 25V  [C0603M]  (hidden comment: 000500)
C56  value 0.1uF 25V  [C0603M]  (hidden comment: 000500)
C57  value 0.1uF 25V  [C0603M]  (hidden comment: 000500)
C58  value 0.1uF 25V  [C0603M]  (hidden comment: 000500)
C59  value 0.1uF 25V  [C0603M]  (hidden comment: 000500)
C61  value 0.1uF 25V  [C0603M]  (hidden comment: 000500)
C62  value 0.1uF 25V  [C0603M]  (hidden comment: 000500)
R28  000501  value 47R 5%  Package: 0603  [R0603M]
U1  000000  value LCMXO2-7000HC-4TG144C  [144-TQFP]  (parts B,C,D,E,F,G of 7)
U7  000000  value IS43R16320F-6TL  [TSOP-66-II]

### Ports
CLK (in), FPGA_CFG (harness FPGA_CFG), FSMC_BUS (harness FSMC_BUS), SPI (harness SPI)

### Harnesses
FSMC_BUS: AD0, AD1, AD2, AD3, AD4, AD5, AD6, AD7, AD8, AD9, AD10, AD11, AD12, AD13, AD14, AD15, CLK, NOE, NWE, NCE, A16
FPGA_CFG: DONE, INITN, PROGRAMN
SPI: NSS, MOSI, MISO, SCK

### Nets
GND: C27#1.2 C45#1.2 C46#1.2 C49.2 C50.2 C51.2 C54.2 C55.2 C56.2 C57.2 C58.2 C59.2 C61.2 C62.2 U7.6(VSSQ) U7.12(VSSQ) U7.34(VSS) U7.48(VSS) U7.52(VSSQ) U7.58(VSSQ) U7.64(VSSQ) U7.66(VSS)
VCC_3.3: C27#1.1 C45#1.1 C46#1.1 C49.1 C50.1 C51.1 C54.1 C55.1 C56.1 C57.1 C58.1 C59.1 C61.1 C62.1 U7.1(VDD) U7.3(VDDQ) U7.9(VDDQ) U7.15(VDDQ) U7.18(VDD) U7.33(VDD) U7.55(VDQQ) U7.61(VDQQ)
CFG_CSSPIN: U1.40(PB6A/CSSPIN) ; port SPI.NSS
CFG_DONE: port FPGA_CFG.DONE
CFG_INIT: port FPGA_CFG.INITN
CFG_MCLK: U1.44(PB12A/MCLK/CCLK) ; port SPI.SCK
CFG_PGMN: U1.119(PT27D/PROGRAMN) ; port FPGA_CFG.PROGRAMN
CFG_SISPI: U1.71(PB38B/SI/SISPI) ; port SPI.MOSI
CFG_SPISO: U1.45(PB12B/SO/SPISO) ; port SPI.MISO
FPGA_CLK: R28.1
FSMC_A16: U1.121(PT25B) ; port FSMC_BUS.A16
FSMC_CLK: U1.127(PT18B/PCLKC0_1) ; port FSMC_BUS.CLK
FSMC_D0: U1.117(PT28A) ; port FSMC_BUS.AD0
FSMC_D1: U1.115(PT28B) ; port FSMC_BUS.AD1
FSMC_D2: U1.114(PT33A) ; port FSMC_BUS.AD2
FSMC_D3: U1.113(PT33B) ; port FSMC_BUS.AD3
FSMC_D4: U1.143(PT9A) ; port FSMC_BUS.AD4
FSMC_D5: U1.142(PT9B) ; port FSMC_BUS.AD5
FSMC_D6: U1.141(PT10A) ; port FSMC_BUS.AD6
FSMC_D7: U1.140(PT10B) ; port FSMC_BUS.AD7
FSMC_D8: U1.139(PT11A) ; port FSMC_BUS.AD8
FSMC_D9: U1.138(PT11B) ; port FSMC_BUS.AD9
FSMC_D10: U1.133(PT15A) ; port FSMC_BUS.AD10
FSMC_D11: U1.132(PT15B) ; port FSMC_BUS.AD11
FSMC_D12: U1.128(PT18A/PCLKT0_1) ; port FSMC_BUS.AD12
FSMC_D13: U1.126(PT22C/SCL/PCLKT0_0) ; port FSMC_BUS.AD13
FSMC_D14: U1.125(PT22D/SDA/PCLKC0_0) ; port FSMC_BUS.AD14
FSMC_D15: U1.122(PT25A) ; port FSMC_BUS.AD15
FSMC_NCE: U1.109(PT36D/DONE) ; port FSMC_BUS.NCE
FSMC_NOE: U1.111(PT35B) ; port FSMC_BUS.NOE
FSMC_NWE: U1.110(PT36C/INITN) ; port FSMC_BUS.NWE
MCO2: R28.2 ; port CLK
SRAM_A0: U1.77(PR21B) U7.29(A0)
SRAM_A1: U1.78(PR21A) U7.30(A1)
SRAM_A2: U1.81(PR18B) U7.31(A2)
SRAM_A3: U1.82(PR18A) U7.32(A3)
SRAM_A4: U1.107(PR2A/R_GPLLT_FB) U7.35(A4)
SRAM_A5: U1.106(PR2B/R_GPLLC_FB) U7.36(A5)
SRAM_A6: U1.105(PR3A/R_GPLLT_IN) U7.37(A6)
SRAM_A7: U1.104(PR3B/R_GPLLC_IN) U7.38(A7)
SRAM_A8: U1.103(PR4C) U7.39(A8)
SRAM_A9: U1.100(PR5A) U7.40(A9)
SRAM_A10: U1.76(PR23A) U7.28(A10/AP)
SRAM_A11: U1.99(PR5B) U7.41(A11)
SRAM_A12: U1.98(PR7A) U7.42(A12)
SRAM_BA0: U1.74(PR24A) U7.26(BA0)
SRAM_BA1: U1.75(PR23B) U7.27(BA1)
SRAM_CAS: U1.69(PB37B) U7.22(~{CAS})
SRAM_CK_N: U1.95(PR9B) U7.46(~{CK})
SRAM_CK_P: U1.96(PR9A) U7.45(CK)
SRAM_CKE: U1.97(PR7B) U7.44(CKE)
SRAM_CS: U1.73(PR24B) U7.24(~{CS})
SRAM_DQ0: U1.56(PB23B/PCLKC2_1) U7.2(DQ0)
SRAM_DQ1: U1.57(PB26A) U7.4(DQ1)
SRAM_DQ2: U1.58(PB26B) U7.5(DQ2)
SRAM_DQ3: U1.59(PB29A) U7.7(DQ3)
SRAM_DQ4: U1.60(PB29B) U7.8(DQ4)
SRAM_DQ5: U1.61(PB31A) U7.10(DQ5)
SRAM_DQ6: U1.62(PB31B) U7.11(DQ6)
SRAM_DQ7: U1.63(PB31D) U7.13(DQ7)
SRAM_DQ8: U1.92(PR12A/PCLKT1_0) U7.54(DQ8)
SRAM_DQ9: U1.91(PR12B/PCLKC1_0) U7.56(DQ9)
SRAM_DQ10: U1.89(PR15A) U7.57(DQ10)
SRAM_DQ11: U1.87(PR15B) U7.59(DQ11)
SRAM_DQ12: U1.86(PR16A) U7.60(DQ12)
SRAM_DQ13: U1.85(PR16B) U7.62(DQ13)
SRAM_DQ14: U1.84(PR17A) U7.63(DQ14)
SRAM_DQ15: U1.83(PR17B) U7.65(DQ15)
SRAM_LDQM: U1.67(PB35B) U7.20(LDM)
SRAM_LDQS: U1.65(PB35A) U7.16(LDQS)
SRAM_RAS: U1.70(PB38A/SN) U7.23(~{RAS})
SRAM_UDQM: U1.94(PR11A) U7.47(UDM)
SRAM_UDQS: U1.93(PR11B) U7.51(UDQS)
SRAM_WE: U1.68(PB37A) U7.21(~{WE})

Not connected (* = marked no-connect by the designer): U1 1(PL3A/L_GPLLT_FB) 2(PL3B/L_GPLLC_FB) 3(PL4A/L_GPLLT_IN) 4(PL4B/L_GPLLC_IN) 5(PL6A/PCLKT5_0) 6(PL6B/PCLKC5_0) 9(PL8A) 10(PL8B) 11(PL9A) 12(PL9B) 13(PL10A) 14(PL10B) 15(PL11A) 17(PL11B) 19(PL12A/PCLKT4_0) 20(PL12B/PCLKC4_0) 21(PL15A) 22(PL15B) 23(PL17A) 24(PL17B) 25(PL19A) 26(PL19B) 27(PL22A/PCLKT3_0) 28(PL22B/PCLKC3_0) 31(PL23D) 32(PL24A) 33(PL24B) 34(PL25A) 35(PL25B) 38(PB4A) 39(PB4B) 41(PB6B) 42(PB9A) 43(PB9B) 47(PB13A) 48(PB13B) 49(PB16A/PCLKT2_0) 50(PB16B/PCLKC2_0) 52(PB18A) 54(PB18B) 55(PB23A/PCLKT2_1) 112(PT35A) 120(PT27C/JTAGENB) 130(PT17D/TMS) 131(PT17C/TCK) 136(PT14D/TDI) 137(PT14C/TDO); U7 49(VREF)

### Buses and harness runs
bus SRAM_A[0..12]
bus SRAM_DQ[0..15]

### Layout directives
differential pair: SRAM_CK_N, SRAM_CK_P
rule Matched Net Lengths [Tolerance = 10mm]: (no net found under the mark)

### Notes on the sheet
- TITLE
- CHK
- DWN
- APV
- DWG
- REV
- File:
- Sheet
- of
- (in symbol LCMXO2-7000HC, part B) Bank 0
- (in symbol LCMXO2-7000HC, part C) Bank 1
- (in symbol LCMXO2-7000HC, part D) Bank 2
- (in symbol LCMXO2-7000HC, part E) Bank 3
- (in symbol LCMXO2-7000HC, part F) Bank 4
- (in symbol LCMXO2-7000HC, part G) Bank 5

### Library data of the parts
C27#1 C45#1 C46#1 C49-C51 C54-C59 C61 C62 = C0603: as C5 on sheet yard-ice-toplevel; PN: 000500; Package: 0603
R28 = R0603: SMD Chip Resistor - 0603; PN: 000501
U1 = LCMXO2-7000HC: FPGA, 6864 Logic Elements, Flash; MF: Lattice; Digy-Key PN: 220-1567-ND; PN: 000000; Package: 144-LQFP; ExtraInfo: *; MF PN: LCMXO2-7000HC-4TG144C
U7 = IS43R16320F-6TL: 512Mbit (64M x16) 167MHz DDR SDRAM; MF: ISSI; PN: 000000; Package: 66-TSOP II; ExtraInfo: *

## Sheet yard-ice-ethernet.SchDoc: Yard-Ice-Ethernet
size 365 x 274 mm; Revision: 1.0; SheetNumber: 5; SheetTotal: 5
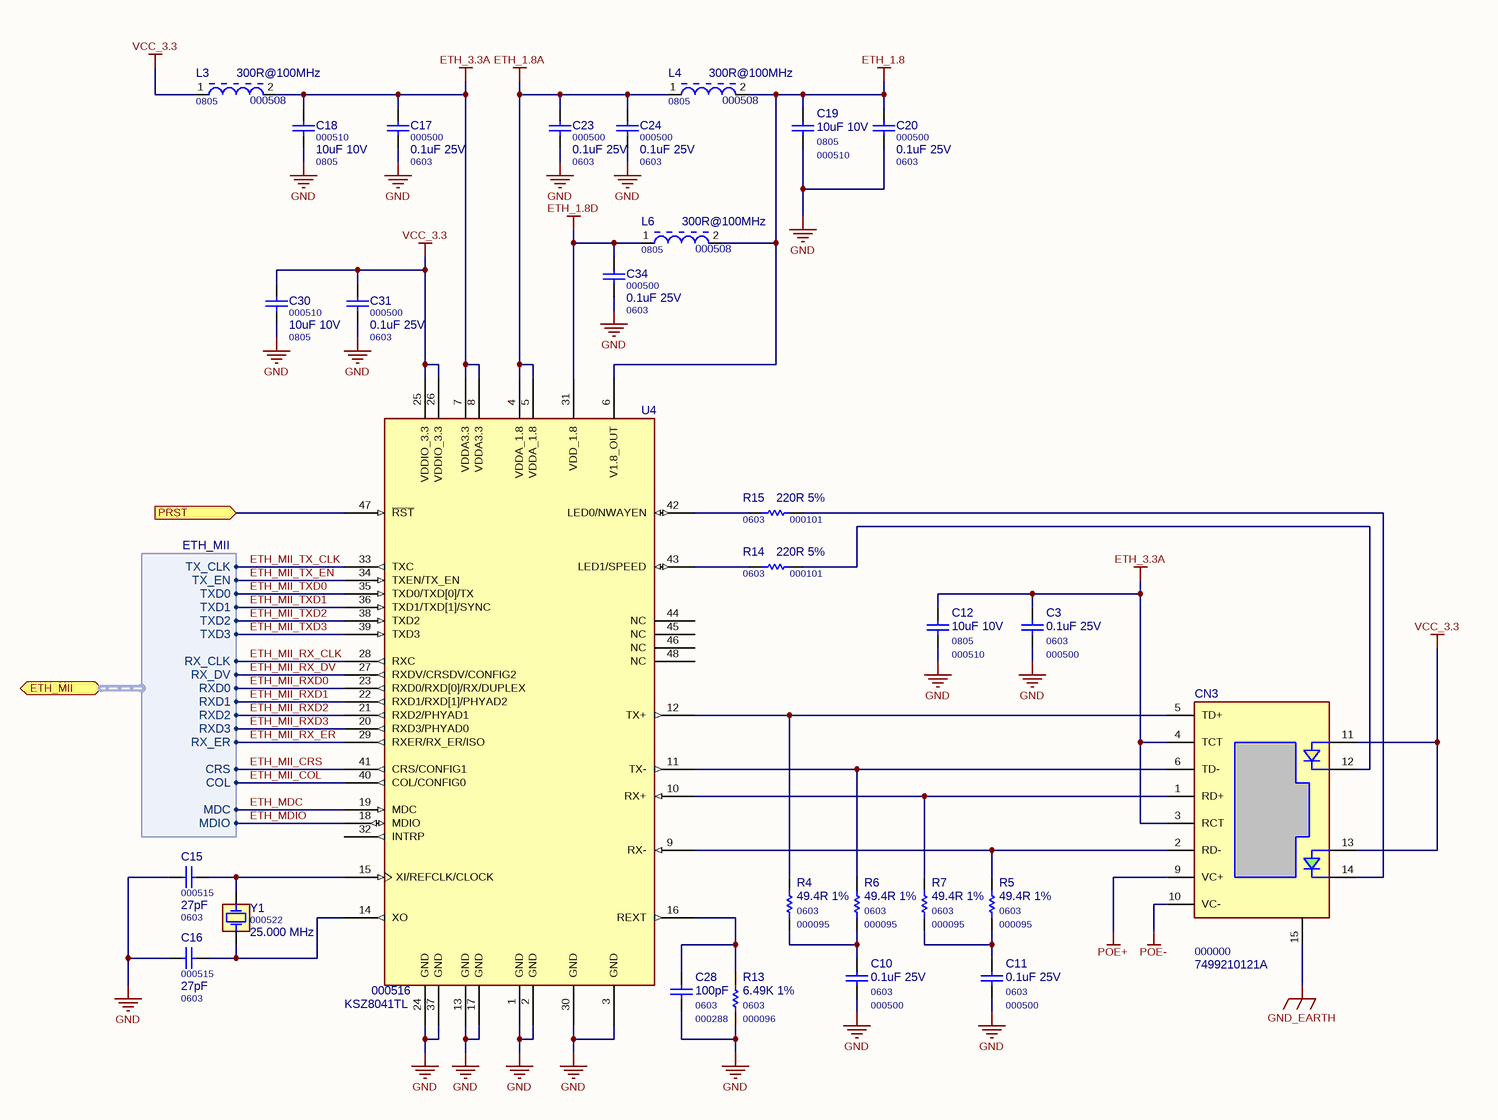
[diagram p4: yard-ice-ethernet.SchDoc]

### Parts
C3  000500  value 0.1uF 25V  Package: 0603  [C0603M]
C10  000500  value 0.1uF 25V  Package: 0603  [C0603M]
C11  000500  value 0.1uF 25V  Package: 0603  [C0603M]
C12  000510  value 10uF 10V  Package: 0805  [C0805M]
C15  000515  value 27pF  Package: 0603  [C0603M]
C16  000515  value 27pF  Package: 0603  [C0603M]
C17  000500  value 0.1uF 25V  Package: 0603  [C0603M]
C18  000510  value 10uF 10V  Package: 0805  [C0805M]
C19  000510  value 10uF 10V  Package: 0805  [C0805M]
C20  000500  value 0.1uF 25V  Package: 0603  [C0603M]
C23  000500  value 0.1uF 25V  Package: 0603  [C0603M]
C24  000500  value 0.1uF 25V  Package: 0603  [C0603M]
C28  000288  value 100pF  Package: 0603  [C0603M]
C30  000510  value 10uF 10V  Package: 0805  [C0805M]
C31  000500  value 0.1uF 25V  Package: 0603  [C0603M]
C34  000500  value 0.1uF 25V  Package: 0603  [C0603M]
CN3  000000  value 7499210121A  [7499210121A]
L3  000508  value 300R@100MHz  Package: 0805  [L0805M]
L4  000508  value 300R@100MHz  Package: 0805  [L0805M]
L6  000508  value 300R@100MHz  Package: 0805  [L0805M]
R4  000095  value 49.4R 1%  Package: 0603  [R0603M]
R5  000095  value 49.4R 1%  Package: 0603  [R0603M]
R6  000095  value 49.4R 1%  Package: 0603  [R0603M]
R7  000095  value 49.4R 1%  Package: 0603  [R0603M]
R13  000096  value 6.49K 1%  Package: 0603  [R0603M]
R14  000101  value 220R 5%  Package: 0603  [R0603M]
R15  000101  value 220R 5%  Package: 0603  [R0603M]
U4  000516  value KSZ8041TL  [48-TQFP]
Y1  000522  value 25.000 MHz  [ABM3-H]

### Ports
ETH_MII (harness ETH_MII), PRST (in)

### Harnesses
ETH_MII: TX_CLK, TX_EN, TXD0, TXD1, TXD2, TXD3, RX_CLK, RX_DV, RXD0, RXD1, RXD2, RXD3, RX_ER, CRS, COL, MDC, MDIO

### Nets
ETH_1.8: C19.1 C20.1 L4.2 L6.2 U4.6(V1.8_OUT)
ETH_1.8A: C23.1 C24.1 L4.1 U4.4(VDDA_1.8) U4.5(VDDA_1.8)
ETH_1.8D: C34.1 L6.1 U4.31(VDD_1.8)
ETH_3.3A: C3.1 C12.1 C17.1 C18.1 CN3.3(RCT) CN3.4(TCT) L3.2 U4.7(VDDA3.3) U4.8(VDDA3.3)
GND: C3.2 C10.2 C11.2 C12.2 C15.1 C16.1 C17.2 C18.2 C19.2 C20.2 C23.2 C24.2 C28.2 C30.2 C31.2 C34.2 R13.1 U4.1(GND) U4.2(GND) U4.3(GND) U4.13(GND) U4.17(GND) U4.24(GND) U4.30(GND) U4.37(GND)
GND_EARTH: CN3.15(SHIELD)
POE+: CN3.9(VC+)
POE-: CN3.10(VC-)
VCC_3.3: C30.1 C31.1 CN3.11(A2) CN3.13(A1) L3.1 U4.25(VDDIO_3.3) U4.26(VDDIO_3.3)
ETH_MDC: U4.19(MDC) ; port ETH_MII.MDC
ETH_MDIO: U4.18(MDIO) ; port ETH_MII.MDIO
ETH_MII_COL: U4.40(COL/CONFIG0) ; port ETH_MII.COL
ETH_MII_CRS: U4.41(CRS/CONFIG1) ; port ETH_MII.CRS
ETH_MII_RX_CLK: U4.28(RXC) ; port ETH_MII.RX_CLK
ETH_MII_RX_DV: U4.27(RXDV/CRSDV/CONFIG2) ; port ETH_MII.RX_DV
ETH_MII_RX_ER: U4.29(RXER/RX_ER/ISO) ; port ETH_MII.RX_ER
ETH_MII_RXD0: U4.23(RXD0/RXD[0]/RX/DUPLEX) ; port ETH_MII.RXD0
ETH_MII_RXD1: U4.22(RXD1/RXD[1]/PHYAD2) ; port ETH_MII.RXD1
ETH_MII_RXD2: U4.21(RXD2/PHYAD1) ; port ETH_MII.RXD2
ETH_MII_RXD3: U4.20(RXD3/PHYAD0) ; port ETH_MII.RXD3
ETH_MII_TX_CLK: U4.33(TXC) ; port ETH_MII.TX_CLK
ETH_MII_TX_EN: U4.34(TXEN/TX_EN) ; port ETH_MII.TX_EN
ETH_MII_TXD0: U4.35(TXD0/TXD[0]/TX) ; port ETH_MII.TXD0
ETH_MII_TXD1: U4.36(TXD1/TXD[1]/SYNC) ; port ETH_MII.TXD1
ETH_MII_TXD2: U4.38(TXD2) ; port ETH_MII.TXD2
ETH_MII_TXD3: U4.39(TXD3) ; port ETH_MII.TXD3
PE5: U4.47(~{RST}) ; port PRST
NetC10_1: C10.1 R4.1 R6.1
NetC11_1: C11.1 R5.1 R7.1
NetC15_2: C15.2 U4.15(XI/REFCLK/CLOCK) Y1.1
NetC16_2: C16.2 U4.14(XO) Y1.2
NetC28_1: C28.1 R13.2 U4.16(REXT)
NetCN3_1: CN3.1(RD+) R7.2 U4.10(RX+)
NetCN3_2: CN3.2(RD-) R5.2 U4.9(RX-)
NetCN3_5: CN3.5(TD+) R4.2 U4.12(TX+)
NetCN3_6: CN3.6(TD-) R6.2 U4.11(TX-)
NetCN3_12: CN3.12(K2) R14.1
NetCN3_14: CN3.14(K1) R15.1
NetR14_2: R14.2 U4.43(LED1/SPEED)
NetR15_2: R15.2 U4.42(LED0/NWAYEN)

Not connected (* = marked no-connect by the designer): U4 32(INTRP) 44(NC) 45(NC) 46(NC) 48(NC)

### Notes on the sheet
- TITLE
- CHK
- DWN
- APV
- DWG
- REV
- File:
- Sheet
- of

### Library data of the parts
C3 C10 C11 C17 C20 C23 C24 C31 C34 = C0603: as C5 on sheet yard-ice-toplevel; PN: 000500
C12 C18 C19 C30 = C0805: as C13 on sheet yard-ice-power; PN: 000510
C15 C16 C28 = C0603: SMD Ceramic Chip Capacitor - 0603
  C15 C16: PN: 000515
  C28: PN: 000288
CN3 = 7499210121A: 10/100Base-TX PoE RJ45; MF: Wurth; Package: PTH; PN: 000000; ExtraInfo: *
L3 L4 L6 = L0805: as L8 on sheet yard-ice-cpu; PN: 000508
R4-R7 R13-R15 = R0603: SMD Chip Resistor - 0603
  R4-R7: PN: 000095
  R13: PN: 000096
  R14 R15: PN: 000101
U4 = KSZ8041TL: 10Base-T/100Base-TX Physical Layer Transceiver; MF: Micrel; PN: 000516; Package: 48-TQFP
Y1 = ABM3: Miniature Ceramic SMD Crystal; MF: Abracon; MF PN: ABM3-25.000MHZ-B2-T; Package: ABM3; PN: 000522

## Sheet yard-ice-fpga-pwr.SchDoc: Yard-Ice-FPGA
size 365 x 274 mm; Revision: 1.0; SheetNumber: 4; SheetTotal: 5
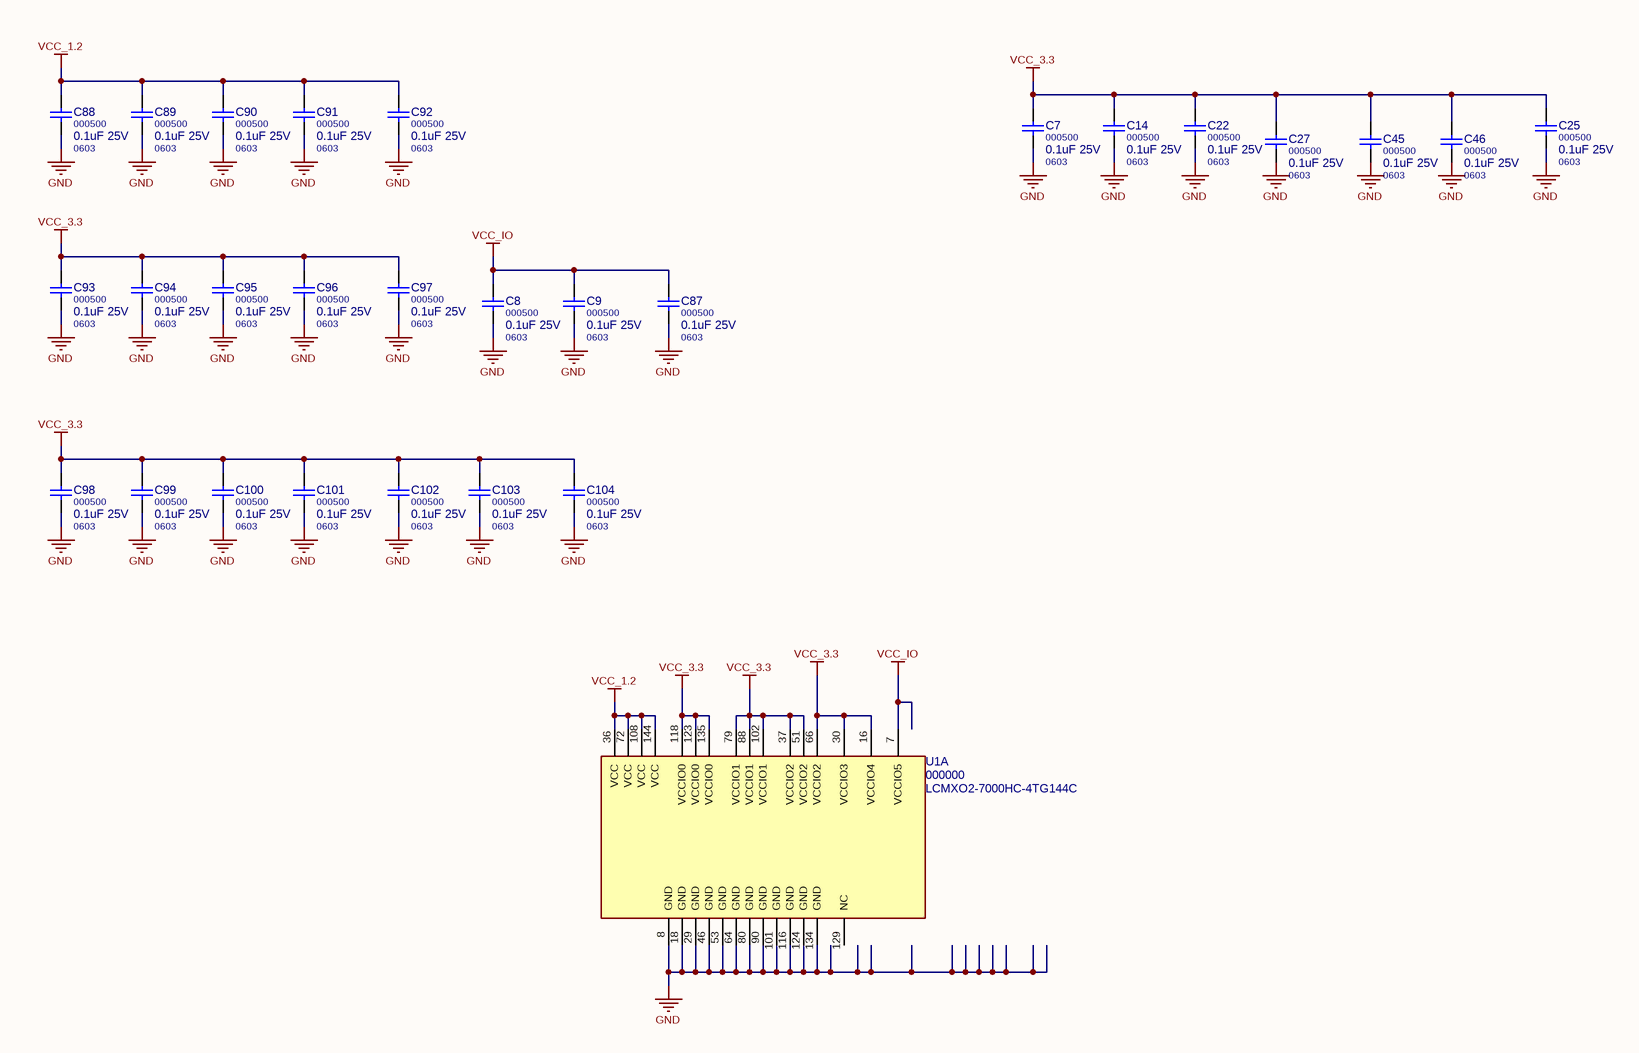
[diagram p5: yard-ice-fpga-pwr.SchDoc]

### Parts
(Parts that share a designator on the sheet are numbered #1, #2 ... from top to bottom, then left to right.)
C7  000500  value 0.1uF 25V  Package: 0603  [C0603M]
C8  000500  value 0.1uF 25V  Package: 0603  [C0603M]
C9  000500  value 0.1uF 25V  Package: 0603  [C0603M]
C14  000500  value 0.1uF 25V  Package: 0603  [C0603M]
C22  000500  value 0.1uF 25V  Package: 0603  [C0603M]
C25  000500  value 0.1uF 25V  Package: 0603  [C0603M]
C27#2  000500  value 0.1uF 25V  Package: 0603  [C0603M]
C45#2  000500  value 0.1uF 25V  Package: 0603  [C0603M]
C46#2  000500  value 0.1uF 25V  Package: 0603  [C0603M]
C87  000500  value 0.1uF 25V  Package: 0603  [C0603M]
C88  000500  value 0.1uF 25V  Package: 0603  [C0603M]
C89  000500  value 0.1uF 25V  Package: 0603  [C0603M]
C90  000500  value 0.1uF 25V  Package: 0603  [C0603M]
C91  000500  value 0.1uF 25V  Package: 0603  [C0603M]
C92  000500  value 0.1uF 25V  Package: 0603  [C0603M]
C93  000500  value 0.1uF 25V  Package: 0603  [C0603M]
C94  000500  value 0.1uF 25V  Package: 0603  [C0603M]
C95  000500  value 0.1uF 25V  Package: 0603  [C0603M]
C96  000500  value 0.1uF 25V  Package: 0603  [C0603M]
C97  000500  value 0.1uF 25V  Package: 0603  [C0603M]
C98  000500  value 0.1uF 25V  Package: 0603  [C0603M]
C99  000500  value 0.1uF 25V  Package: 0603  [C0603M]
C100  000500  value 0.1uF 25V  Package: 0603  [C0603M]
C101  000500  value 0.1uF 25V  Package: 0603  [C0603M]
C102  000500  value 0.1uF 25V  Package: 0603  [C0603M]
C103  000500  value 0.1uF 25V  Package: 0603  [C0603M]
C104  000500  value 0.1uF 25V  Package: 0603  [C0603M]
U1  000000  value LCMXO2-7000HC-4TG144C  [144-TQFP]  (part A of 7)

### Nets
GND: C7.2 C8.2 C9.2 C14.2 C22.2 C25.2 C27#2.2 C45#2.2 C46#2.2 C87.2 C88.2 C89.2 C90.2 C91.2 C92.2 C93.2 C94.2 C95.2 C96.2 C97.2 C98.2 C99.2 C100.2 C101.2 C102.2 C103.2 C104.2 U1.8(GND) U1.18(GND) U1.29(GND) U1.46(GND) U1.53(GND) U1.64(GND) U1.80(GND) U1.90(GND) U1.101(GND) U1.116(GND) U1.124(GND) U1.134(GND)
VCC_1.2: C88.1 C89.1 C90.1 C91.1 C92.1 U1.36(VCC) U1.72(VCC) U1.108(VCC) U1.144(VCC)
VCC_3.3: C7.1 C14.1 C22.1 C25.1 C27#2.1 C45#2.1 C46#2.1 C93.1 C94.1 C95.1 C96.1 C97.1 C98.1 C99.1 C100.1 C101.1 C102.1 C103.1 C104.1 U1.16(VCCIO4) U1.30(VCCIO3) U1.37(VCCIO2) U1.51(VCCIO2) U1.66(VCCIO2) U1.79(VCCIO1) U1.88(VCCIO1) U1.102(VCCIO1) U1.118(VCCIO0) U1.123(VCCIO0) U1.135(VCCIO0)
VCC_IO: C8.1 C9.1 C87.1 U1.7(VCCIO5)

Not connected (* = marked no-connect by the designer): U1 129(NC)

### Notes on the sheet
- TITLE
- CHK
- DWN
- APV
- DWG
- REV
- File:
- Sheet
- of

### Library data of the parts
C7-C9 C14 C22 C25 C27#2 C45#2 C46#2 C87-C104 = C0603: as C5 on sheet yard-ice-toplevel; PN: 000500
U1 = LCMXO2-7000HC: FPGA, 1280 Logic Elements, OTP; MF: Lattice; Digy-Key PN: 220-1567-ND; PN: 000000; Package: 144-LQFP; ExtraInfo: *; MF PN: LCMXO2-7000HC-4TG144C

## Nets that join several sheets
GND: yard-ice-toplevel (10 pins), yard-ice-power (21 pins), yard-ice-cpu (27 pins), yard-ice-fpga (22 pins), yard-ice-ethernet (25 pins), yard-ice-fpga-pwr (39 pins)
GND_EARTH: yard-ice-power (C1.1), yard-ice-ethernet (CN3.15)
POE+: yard-ice-power (11 pins), yard-ice-ethernet (CN3.9)
POE-: yard-ice-power (5 pins), yard-ice-ethernet (CN3.10)
VCC_1.2: yard-ice-power (C35.1 C43.1 L7.2 R18.2), yard-ice-fpga-pwr (9 pins)
VCC_3.3: yard-ice-toplevel (5 pins), yard-ice-power (C21.1 C26.1 L5.2 R11.2), yard-ice-cpu (19 pins), yard-ice-fpga (22 pins), yard-ice-ethernet (7 pins), yard-ice-fpga-pwr (30 pins)
VCC_5: yard-ice-toplevel (D6.2 K1.1), yard-ice-power (18 pins)
VCC_IO: yard-ice-power (C77.1 Q2.4 R34.1), yard-ice-fpga-pwr (C8.1 C9.1 C87.1 U1.7)
DAC2_OUT: yard-ice-power (C69.1 R30.2 U8.1), yard-ice-cpu (U6.30)
ETH_MDC: yard-ice-cpu (U6.16), yard-ice-ethernet (U4.19)
ETH_MDIO: yard-ice-cpu (R48.1 U6.25), yard-ice-ethernet (U4.18)
ETH_MII_COL: yard-ice-cpu (U6.26), yard-ice-ethernet (U4.40)
ETH_MII_CRS: yard-ice-cpu (U6.23), yard-ice-ethernet (U4.41)
ETH_MII_RX_CLK: yard-ice-cpu (U6.24), yard-ice-ethernet (U4.28)
ETH_MII_RX_DV: yard-ice-cpu (U6.32), yard-ice-ethernet (U4.27)
ETH_MII_RX_ER: yard-ice-cpu (U6.47), yard-ice-ethernet (U4.29)
ETH_MII_RXD0: yard-ice-cpu (U6.33), yard-ice-ethernet (U4.23)
ETH_MII_RXD1: yard-ice-cpu (U6.34), yard-ice-ethernet (U4.22)
ETH_MII_RXD2: yard-ice-cpu (U6.35), yard-ice-ethernet (U4.21)
ETH_MII_RXD3: yard-ice-cpu (U6.36), yard-ice-ethernet (U4.20)
ETH_MII_TX_CLK: yard-ice-cpu (U6.18), yard-ice-ethernet (U4.33)
ETH_MII_TX_EN: yard-ice-cpu (U6.48), yard-ice-ethernet (U4.34)
ETH_MII_TXD0: yard-ice-cpu (U6.51), yard-ice-ethernet (U4.35)
ETH_MII_TXD1: yard-ice-cpu (U6.52), yard-ice-ethernet (U4.36)
ETH_MII_TXD2: yard-ice-cpu (U6.17), yard-ice-ethernet (U4.38)
ETH_MII_TXD3: yard-ice-cpu (U6.95), yard-ice-ethernet (U4.39)
FSMC_CLK: yard-ice-cpu (U6.84), yard-ice-fpga (U1.127)
FSMC_D0: yard-ice-cpu (U6.61), yard-ice-fpga (U1.117)
FSMC_D1: yard-ice-cpu (U6.62), yard-ice-fpga (U1.115)
FSMC_D2: yard-ice-cpu (U6.81), yard-ice-fpga (U1.114)
FSMC_D3: yard-ice-cpu (U6.82), yard-ice-fpga (U1.113)
FSMC_D4: yard-ice-cpu (U6.38), yard-ice-fpga (U1.143)
FSMC_D5: yard-ice-cpu (U6.39), yard-ice-fpga (U1.142)
FSMC_D6: yard-ice-cpu (U6.40), yard-ice-fpga (U1.141)
FSMC_D7: yard-ice-cpu (U6.41), yard-ice-fpga (U1.140)
FSMC_D8: yard-ice-cpu (U6.42), yard-ice-fpga (U1.139)
FSMC_D9: yard-ice-cpu (U6.43), yard-ice-fpga (U1.138)
FSMC_D10: yard-ice-cpu (U6.44), yard-ice-fpga (U1.133)
FSMC_D11: yard-ice-cpu (U6.45), yard-ice-fpga (U1.132)
FSMC_D12: yard-ice-cpu (U6.46), yard-ice-fpga (U1.128)
FSMC_D13: yard-ice-cpu (U6.55), yard-ice-fpga (U1.126)
FSMC_D14: yard-ice-cpu (U6.56), yard-ice-fpga (U1.125)
FSMC_D15: yard-ice-cpu (U6.57), yard-ice-fpga (U1.122)
FSMC_NCE: yard-ice-cpu (U6.88), yard-ice-fpga (U1.109)
FSMC_NOE: yard-ice-cpu (U6.85), yard-ice-fpga (U1.111)
FSMC_NWE: yard-ice-cpu (U6.86), yard-ice-fpga (U1.110)
JTCK: yard-ice-toplevel (P3.7), yard-ice-cpu (U6.76)
JTDI: yard-ice-toplevel (P3.3), yard-ice-cpu (U6.77)
JTDO: yard-ice-toplevel (P3.5), yard-ice-cpu (U6.89)
JTMS: yard-ice-toplevel (P3.1), yard-ice-cpu (U6.72)
JTRST: yard-ice-toplevel (P3.9), yard-ice-cpu (U6.90)
MCO2: yard-ice-cpu (U6.66), yard-ice-fpga (R28.2)
NRST: yard-ice-toplevel (P3.4), yard-ice-cpu (U6.14)
OTG_FS_DM: yard-ice-toplevel (U19.3), yard-ice-cpu (U6.70)
OTG_FS_DP: yard-ice-toplevel (U19.1), yard-ice-cpu (U6.71)
OTG_FS_VBUS: yard-ice-toplevel (C5.1 FB1.2), yard-ice-power (D2.1), yard-ice-cpu (U6.68)
PB15: yard-ice-toplevel (U10.1), yard-ice-cpu (U6.54)
PE5: yard-ice-cpu (U6.4), yard-ice-ethernet (U4.47)
SPI2_NSS: yard-ice-toplevel (Q1.1), yard-ice-cpu (U6.96)
SPI3_MISO: yard-ice-toplevel (U10.2), yard-ice-cpu (U6.79)
SPI3_MOSI: yard-ice-toplevel (U10.5), yard-ice-cpu (U6.91)
SPI3_SCK: yard-ice-toplevel (U10.6), yard-ice-cpu (U6.78)